# EAGLE design Linesensors (EAGLE 9.6.0)
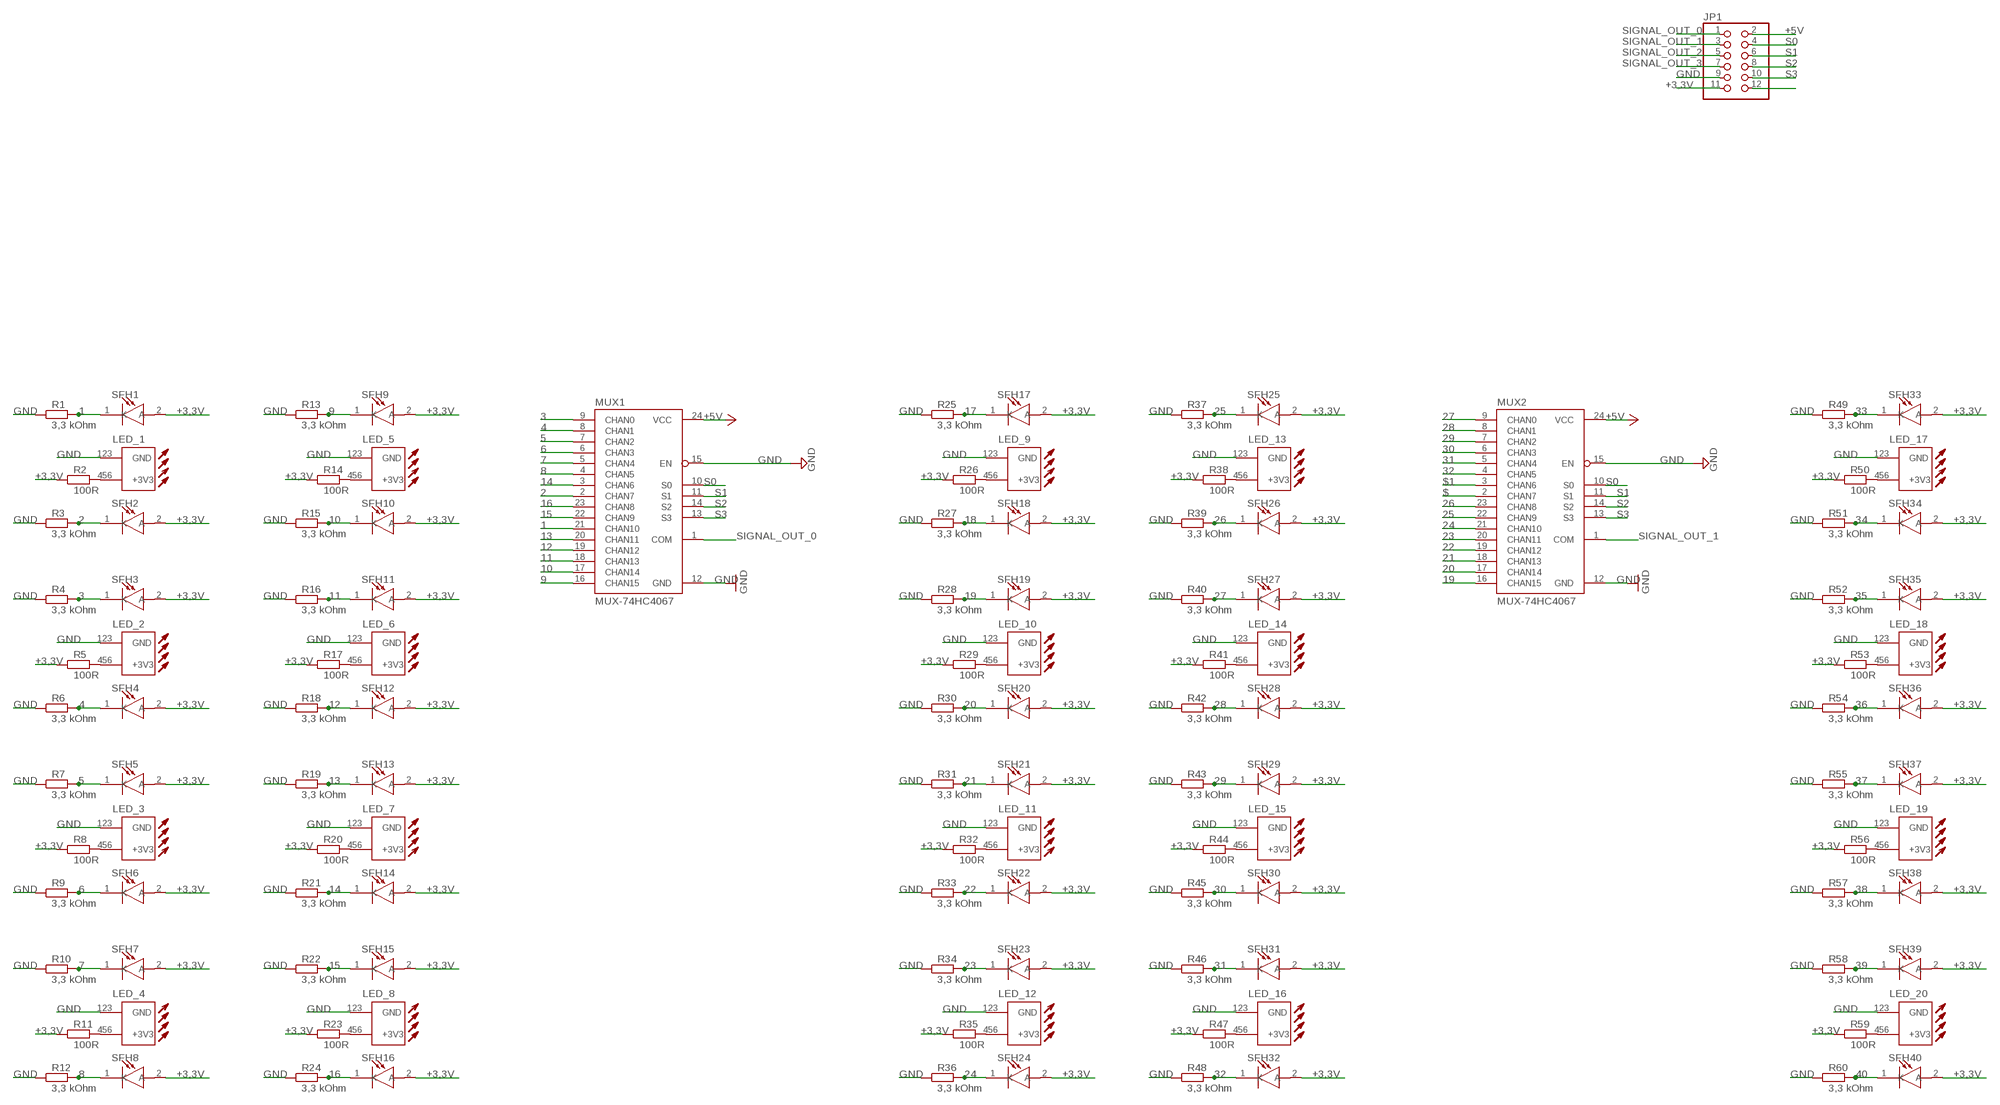
[diagram p0: schematic, sheet 1, part 1 of 2]
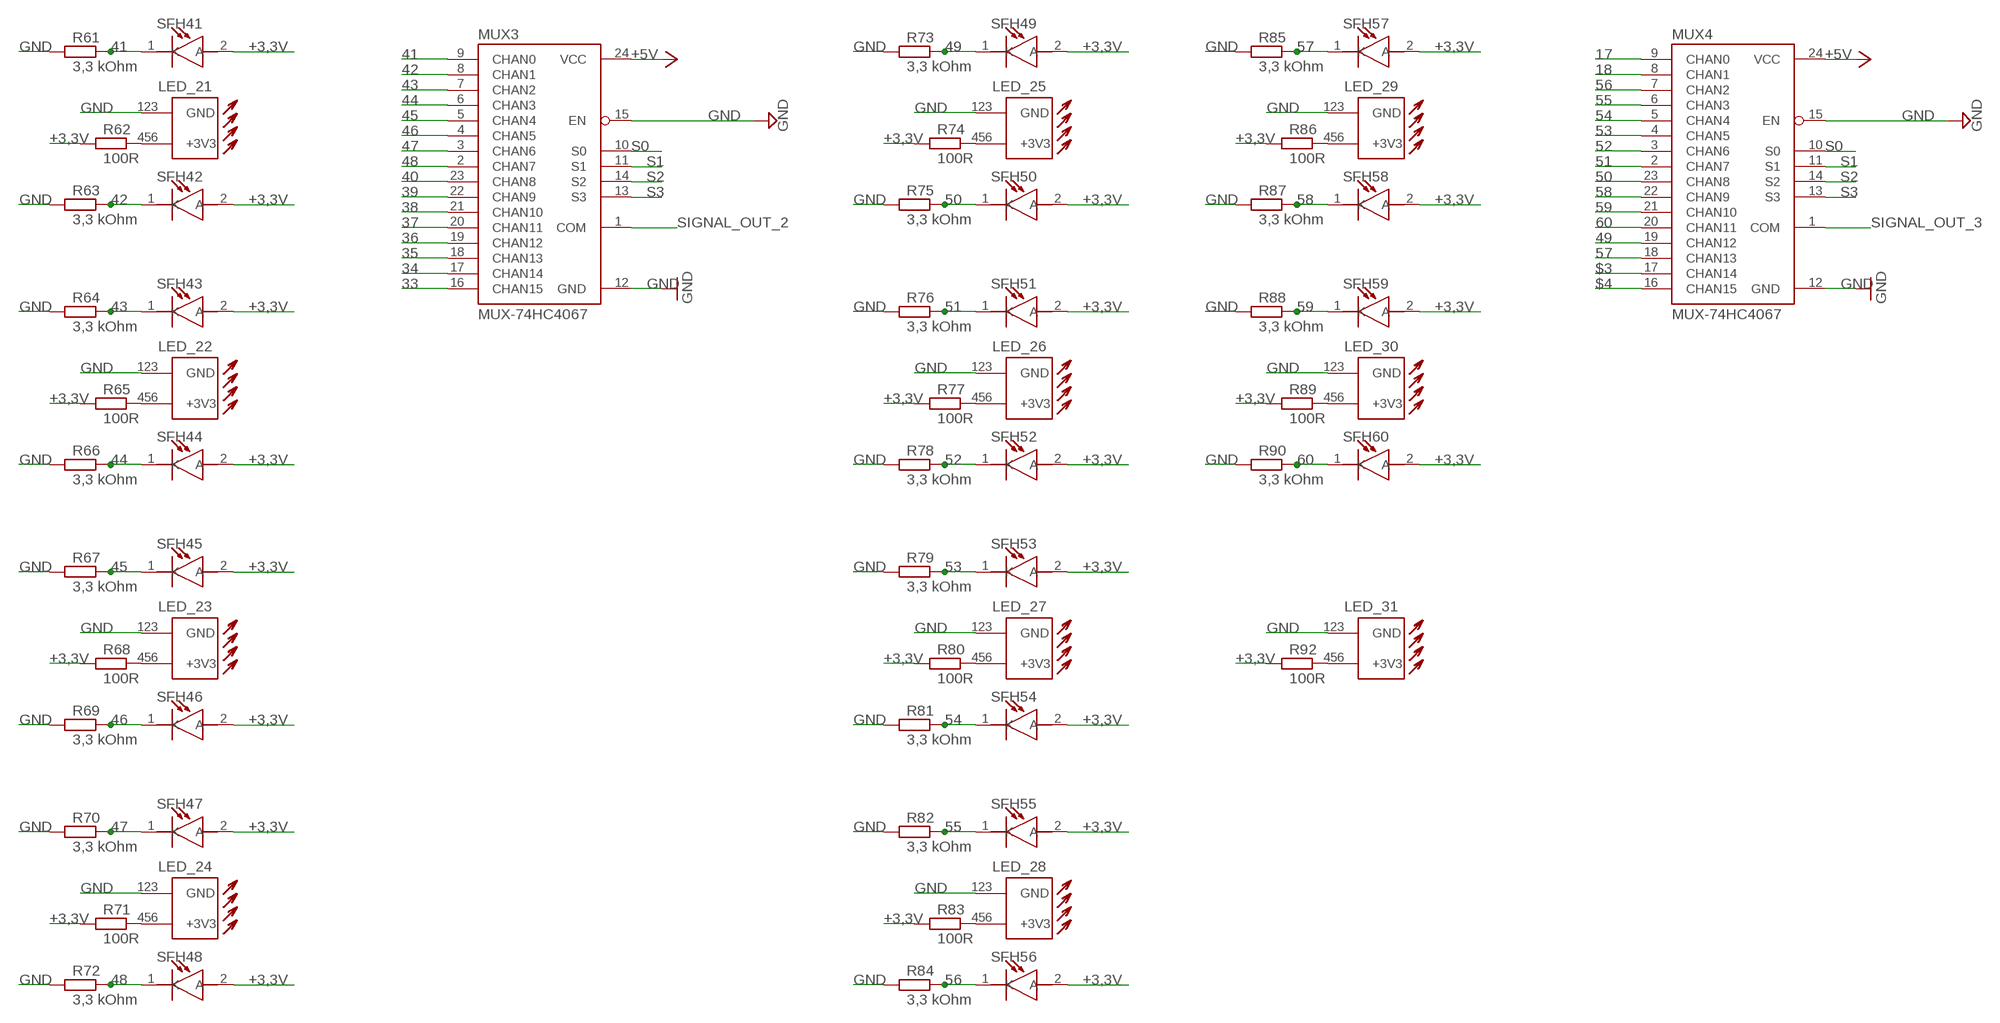
[diagram p1: schematic, sheet 1, part 2 of 2]

## Parts
JP1  PINHD-2X6  [2X06]
LED_1  RND135-00056LEDD  [LED]
LED_2  RND135-00056LEDD  [LED]
LED_3  RND135-00056LEDD  [LED]
LED_4  RND135-00056LEDD  [LED]
LED_5  RND135-00056LEDD  [LED]
LED_6  RND135-00056LEDD  [LED]
LED_7  RND135-00056LEDD  [LED]
LED_8  RND135-00056LEDD  [LED]
LED_9  RND135-00056LEDD  [LED]
LED_10  RND135-00056LEDD  [LED]
LED_11  RND135-00056LEDD  [LED]
LED_12  RND135-00056LEDD  [LED]
LED_13  RND135-00056LEDD  [LED]
LED_14  RND135-00056LEDD  [LED]
LED_15  RND135-00056LEDD  [LED]
LED_16  RND135-00056LEDD  [LED]
LED_17  RND135-00056LEDD  [LED]
LED_18  RND135-00056LEDD  [LED]
LED_19  RND135-00056LEDD  [LED]
LED_20  RND135-00056LEDD  [LED]
LED_21  RND135-00056LEDD  [LED]
LED_22  RND135-00056LEDD  [LED]
LED_23  RND135-00056LEDD  [LED]
LED_24  RND135-00056LEDD  [LED]
LED_25  RND135-00056LEDD  [LED]
LED_26  RND135-00056LEDD  [LED]
LED_27  RND135-00056LEDD  [LED]
LED_28  RND135-00056LEDD  [LED]
LED_29  RND135-00056LEDD  [LED]
LED_30  RND135-00056LEDD  [LED]
LED_31  RND135-00056LEDD  [LED]
MUX1  MUX-74HC4067  MUX-74HC4067SMD  [SSOP24]
MUX2  MUX-74HC4067  MUX-74HC4067SMD  [SSOP24]
MUX3  MUX-74HC4067  MUX-74HC4067SMD  [SSOP24]
MUX4  MUX-74HC4067  MUX-74HC4067SMD  [SSOP24]
R1  3,3 kOhm  R-EU_R1206  [R1206]
R2  100R  R-EU_R1206  [R1206]
R3  3,3 kOhm  R-EU_R1206  [R1206]
R4  3,3 kOhm  R-EU_R1206  [R1206]
R5  100R  R-EU_R1206  [R1206]
R6  3,3 kOhm  R-EU_R1206  [R1206]
R7  3,3 kOhm  R-EU_R1206  [R1206]
R8  100R  R-EU_R1206  [R1206]
R9  3,3 kOhm  R-EU_R1206  [R1206]
R10  3,3 kOhm  R-EU_R1206  [R1206]
R11  100R  R-EU_R1206  [R1206]
R12  3,3 kOhm  R-EU_R1206  [R1206]
R13  3,3 kOhm  R-EU_R1206  [R1206]
R14  100R  R-EU_R1206  [R1206]
R15  3,3 kOhm  R-EU_R1206  [R1206]
R16  3,3 kOhm  R-EU_R1206  [R1206]
R17  100R  R-EU_R1206  [R1206]
R18  3,3 kOhm  R-EU_R1206  [R1206]
R19  3,3 kOhm  R-EU_R1206  [R1206]
R20  100R  R-EU_R1206  [R1206]
R21  3,3 kOhm  R-EU_R1206  [R1206]
R22  3,3 kOhm  R-EU_R1206  [R1206]
R23  100R  R-EU_R1206  [R1206]
R24  3,3 kOhm  R-EU_R1206  [R1206]
R25  3,3 kOhm  R-EU_R1206  [R1206]
R26  100R  R-EU_R1206  [R1206]
R27  3,3 kOhm  R-EU_R1206  [R1206]
R28  3,3 kOhm  R-EU_R1206  [R1206]
R29  100R  R-EU_R1206  [R1206]
R30  3,3 kOhm  R-EU_R1206  [R1206]
R31  3,3 kOhm  R-EU_R1206  [R1206]
R32  100R  R-EU_R1206  [R1206]
R33  3,3 kOhm  R-EU_R1206  [R1206]
R34  3,3 kOhm  R-EU_R1206  [R1206]
R35  100R  R-EU_R1206  [R1206]
R36  3,3 kOhm  R-EU_R1206  [R1206]
R37  3,3 kOhm  R-EU_R1206  [R1206]
R38  100R  R-EU_R1206  [R1206]
R39  3,3 kOhm  R-EU_R1206  [R1206]
R40  3,3 kOhm  R-EU_R1206  [R1206]
R41  100R  R-EU_R1206  [R1206]
R42  3,3 kOhm  R-EU_R1206  [R1206]
R43  3,3 kOhm  R-EU_R1206  [R1206]
R44  100R  R-EU_R1206  [R1206]
R45  3,3 kOhm  R-EU_R1206  [R1206]
R46  3,3 kOhm  R-EU_R1206  [R1206]
R47  100R  R-EU_R1206  [R1206]
R48  3,3 kOhm  R-EU_R1206  [R1206]
R49  3,3 kOhm  R-EU_R1206  [R1206]
R50  100R  R-EU_R1206  [R1206]
R51  3,3 kOhm  R-EU_R1206  [R1206]
R52  3,3 kOhm  R-EU_R1206  [R1206]
R53  100R  R-EU_R1206  [R1206]
R54  3,3 kOhm  R-EU_R1206  [R1206]
R55  3,3 kOhm  R-EU_R1206  [R1206]
R56  100R  R-EU_R1206  [R1206]
R57  3,3 kOhm  R-EU_R1206  [R1206]
R58  3,3 kOhm  R-EU_R1206  [R1206]
R59  100R  R-EU_R1206  [R1206]
R60  3,3 kOhm  R-EU_R1206  [R1206]
R61  3,3 kOhm  R-EU_R1206  [R1206]
R62  100R  R-EU_R1206  [R1206]
R63  3,3 kOhm  R-EU_R1206  [R1206]
R64  3,3 kOhm  R-EU_R1206  [R1206]
R65  100R  R-EU_R1206  [R1206]
R66  3,3 kOhm  R-EU_R1206  [R1206]
R67  3,3 kOhm  R-EU_R1206  [R1206]
R68  100R  R-EU_R1206  [R1206]
R69  3,3 kOhm  R-EU_R1206  [R1206]
R70  3,3 kOhm  R-EU_R1206  [R1206]
R71  100R  R-EU_R1206  [R1206]
R72  3,3 kOhm  R-EU_R1206  [R1206]
R73  3,3 kOhm  R-EU_R1206  [R1206]
R74  100R  R-EU_R1206  [R1206]
R75  3,3 kOhm  R-EU_R1206  [R1206]
R76  3,3 kOhm  R-EU_R1206  [R1206]
R77  100R  R-EU_R1206  [R1206]
R78  3,3 kOhm  R-EU_R1206  [R1206]
R79  3,3 kOhm  R-EU_R1206  [R1206]
R80  100R  R-EU_R1206  [R1206]
R81  3,3 kOhm  R-EU_R1206  [R1206]
R82  3,3 kOhm  R-EU_R1206  [R1206]
R83  100R  R-EU_R1206  [R1206]
R84  3,3 kOhm  R-EU_R1206  [R1206]
R85  3,3 kOhm  R-EU_R1206  [R1206]
R86  100R  R-EU_R1206  [R1206]
R87  3,3 kOhm  R-EU_R1206  [R1206]
R88  3,3 kOhm  R-EU_R1206  [R1206]
R89  100R  R-EU_R1206  [R1206]
R90  3,3 kOhm  R-EU_R1206  [R1206]
R92  100R  R-EU_R1206  [R1206]
SFH1  SFH_3716  [LEDC2012X89N]
SFH2  SFH_3716  [LEDC2012X89N]
SFH3  SFH_3716  [LEDC2012X89N]
SFH4  SFH_3716  [LEDC2012X89N]
SFH5  SFH_3716  [LEDC2012X89N]
SFH6  SFH_3716  [LEDC2012X89N]
SFH7  SFH_3716  [LEDC2012X89N]
SFH8  SFH_3716  [LEDC2012X89N]
SFH9  SFH_3716  [LEDC2012X89N]
SFH10  SFH_3716  [LEDC2012X89N]
SFH11  SFH_3716  [LEDC2012X89N]
SFH12  SFH_3716  [LEDC2012X89N]
SFH13  SFH_3716  [LEDC2012X89N]
SFH14  SFH_3716  [LEDC2012X89N]
SFH15  SFH_3716  [LEDC2012X89N]
SFH16  SFH_3716  [LEDC2012X89N]
SFH17  SFH_3716  [LEDC2012X89N]
SFH18  SFH_3716  [LEDC2012X89N]
SFH19  SFH_3716  [LEDC2012X89N]
SFH20  SFH_3716  [LEDC2012X89N]
SFH21  SFH_3716  [LEDC2012X89N]
SFH22  SFH_3716  [LEDC2012X89N]
SFH23  SFH_3716  [LEDC2012X89N]
SFH24  SFH_3716  [LEDC2012X89N]
SFH25  SFH_3716  [LEDC2012X89N]
SFH26  SFH_3716  [LEDC2012X89N]
SFH27  SFH_3716  [LEDC2012X89N]
SFH28  SFH_3716  [LEDC2012X89N]
SFH29  SFH_3716  [LEDC2012X89N]
SFH30  SFH_3716  [LEDC2012X89N]
SFH31  SFH_3716  [LEDC2012X89N]
SFH32  SFH_3716  [LEDC2012X89N]
SFH33  SFH_3716  [LEDC2012X89N]
SFH34  SFH_3716  [LEDC2012X89N]
SFH35  SFH_3716  [LEDC2012X89N]
SFH36  SFH_3716  [LEDC2012X89N]
SFH37  SFH_3716  [LEDC2012X89N]
SFH38  SFH_3716  [LEDC2012X89N]
SFH39  SFH_3716  [LEDC2012X89N]
SFH40  SFH_3716  [LEDC2012X89N]
SFH41  SFH_3716  [LEDC2012X89N]
SFH42  SFH_3716  [LEDC2012X89N]
SFH43  SFH_3716  [LEDC2012X89N]
SFH44  SFH_3716  [LEDC2012X89N]
SFH45  SFH_3716  [LEDC2012X89N]
SFH46  SFH_3716  [LEDC2012X89N]
SFH47  SFH_3716  [LEDC2012X89N]
SFH48  SFH_3716  [LEDC2012X89N]
SFH49  SFH_3716  [LEDC2012X89N]
SFH50  SFH_3716  [LEDC2012X89N]
SFH51  SFH_3716  [LEDC2012X89N]
SFH52  SFH_3716  [LEDC2012X89N]
SFH53  SFH_3716  [LEDC2012X89N]
SFH54  SFH_3716  [LEDC2012X89N]
SFH55  SFH_3716  [LEDC2012X89N]
SFH56  SFH_3716  [LEDC2012X89N]
SFH57  SFH_3716  [LEDC2012X89N]
SFH58  SFH_3716  [LEDC2012X89N]
SFH59  SFH_3716  [LEDC2012X89N]
SFH60  SFH_3716  [LEDC2012X89N]

## Nets
1: MUX1.21(CHAN10) R1.2 SFH1.1(K)
2: MUX1.2(CHAN7) R3.2 SFH2.1(K)
3: MUX1.9(CHAN0) R4.2 SFH3.1(K)
4: MUX1.8(CHAN1) R6.2 SFH4.1(K)
5: MUX1.7(CHAN2) R7.2 SFH5.1(K)
6: MUX1.6(CHAN3) R9.2 SFH6.1(K)
7: MUX1.5(CHAN4) R10.2 SFH7.1(K)
8: MUX1.4(CHAN5) R12.2 SFH8.1(K)
9: MUX1.16(CHAN15) R13.2 SFH9.1(K)
10: MUX1.17(CHAN14) R15.2 SFH10.1(K)
11: MUX1.18(CHAN13) R16.2 SFH11.1(K)
12: MUX1.19(CHAN12) R18.2 SFH12.1(K)
13: MUX1.20(CHAN11) R19.2 SFH13.1(K)
14: MUX1.3(CHAN6) R21.2 SFH14.1(K)
15: MUX1.22(CHAN9) R22.2 SFH15.1(K)
16: MUX1.23(CHAN8) R24.2 SFH16.1(K)
17: MUX4.9(CHAN0) R25.2 SFH17.1(K)
18: MUX4.8(CHAN1) R27.2 SFH18.1(K)
19: MUX2.16(CHAN15) R28.2 SFH19.1(K)
20: MUX2.17(CHAN14) R30.2 SFH20.1(K)
21: MUX2.18(CHAN13) R31.2 SFH21.1(K)
22: MUX2.19(CHAN12) R33.2 SFH22.1(K)
23: MUX2.20(CHAN11) R34.2 SFH23.1(K)
24: MUX2.21(CHAN10) R36.2 SFH24.1(K)
25: MUX2.22(CHAN9) R37.2 SFH25.1(K)
26: MUX2.23(CHAN8) R39.2 SFH26.1(K)
27: MUX2.9(CHAN0) R40.2 SFH27.1(K)
28: MUX2.8(CHAN1) R42.2 SFH28.1(K)
29: MUX2.7(CHAN2) R43.2 SFH29.1(K)
30: MUX2.6(CHAN3) R45.2 SFH30.1(K)
31: MUX2.5(CHAN4) R46.2 SFH31.1(K)
32: MUX2.4(CHAN5) R48.2 SFH32.1(K)
33: MUX3.16(CHAN15) R49.2 SFH33.1(K)
34: MUX3.17(CHAN14) R51.2 SFH34.1(K)
35: MUX3.18(CHAN13) R52.2 SFH35.1(K)
36: MUX3.19(CHAN12) R54.2 SFH36.1(K)
37: MUX3.20(CHAN11) R55.2 SFH37.1(K)
38: MUX3.21(CHAN10) R57.2 SFH38.1(K)
39: MUX3.22(CHAN9) R58.2 SFH39.1(K)
40: MUX3.23(CHAN8) R60.2 SFH40.1(K)
41: MUX3.9(CHAN0) R61.2 SFH41.1(K)
42: MUX3.8(CHAN1) R63.2 SFH42.1(K)
43: MUX3.7(CHAN2) R64.2 SFH43.1(K)
44: MUX3.6(CHAN3) R66.2 SFH44.1(K)
45: MUX3.5(CHAN4) R67.2 SFH45.1(K)
46: MUX3.4(CHAN5) R69.2 SFH46.1(K)
47: MUX3.3(CHAN6) R70.2 SFH47.1(K)
48: MUX3.2(CHAN7) R72.2 SFH48.1(K)
49: MUX4.19(CHAN12) R73.2 SFH49.1(K)
50: MUX4.23(CHAN8) R75.2 SFH50.1(K)
51: MUX4.2(CHAN7) R76.2 SFH51.1(K)
52: MUX4.3(CHAN6) R78.2 SFH52.1(K)
53: MUX4.4(CHAN5) R79.2 SFH53.1(K)
54: MUX4.5(CHAN4) R81.2 SFH54.1(K)
55: MUX4.6(CHAN3) R82.2 SFH55.1(K)
56: MUX4.7(CHAN2) R84.2 SFH56.1(K)
57: MUX4.18(CHAN13) R85.2 SFH57.1(K)
58: MUX4.22(CHAN9) R87.2 SFH58.1(K)
59: MUX4.21(CHAN10) R88.2 SFH59.1(K)
60: MUX4.20(CHAN11) R90.2 SFH60.1(K)
$: MUX2.2(CHAN7)
$1: MUX2.3(CHAN6)
$3: MUX4.17(CHAN14)
$4: MUX4.16(CHAN15)
+3,3V: JP1.11 R2.1 R5.1 R8.1 R11.1 R14.1 R17.1 R20.1 R23.1 R26.1 R29.1 R32.1 R35.1 R38.1 R41.1 R44.1 R47.1 R50.1 R53.1 R56.1 R59.1 R62.1 R65.1 R68.1 R71.1 R74.1 R77.1 R80.1 R83.1 R86.1 R89.1 R92.1 SFH1.2(A) SFH2.2(A) SFH3.2(A) SFH4.2(A) SFH5.2(A) SFH6.2(A) SFH7.2(A) SFH8.2(A) SFH9.2(A) SFH10.2(A) SFH11.2(A) SFH12.2(A) SFH13.2(A) SFH14.2(A) SFH15.2(A) SFH16.2(A) SFH17.2(A) SFH18.2(A) SFH19.2(A) SFH20.2(A) SFH21.2(A) SFH22.2(A) SFH23.2(A) SFH24.2(A) SFH25.2(A) SFH26.2(A) SFH27.2(A) SFH28.2(A) SFH29.2(A) SFH30.2(A) SFH31.2(A) SFH32.2(A) SFH33.2(A) SFH34.2(A) SFH35.2(A) SFH36.2(A) SFH37.2(A) SFH38.2(A) SFH39.2(A) SFH40.2(A) SFH41.2(A) SFH42.2(A) SFH43.2(A) SFH44.2(A) SFH45.2(A) SFH46.2(A) SFH47.2(A) SFH48.2(A) SFH49.2(A) SFH50.2(A) SFH51.2(A) SFH52.2(A) SFH53.2(A) SFH54.2(A) SFH55.2(A) SFH56.2(A) SFH57.2(A) SFH58.2(A) SFH59.2(A) SFH60.2(A)
+5V: JP1.2 MUX1.24(VCC) MUX2.24(VCC) MUX3.24(VCC) MUX4.24(VCC)
ADFAF1: LED_2.456(+3V3) R5.2
ADFAF2: LED_3.456(+3V3) R8.2
ADFAF3: LED_4.456(+3V3) R11.2
ADFAF4: LED_1.456(+3V3) R2.2
ADFAF5: LED_5.456(+3V3) R14.2
ADFAF6: LED_6.456(+3V3) R17.2
ADFAF7: LED_7.456(+3V3) R20.2
ADFAF8: LED_8.456(+3V3) R23.2
ADFAF9: LED_9.456(+3V3) R26.2
ADFAF10: LED_10.456(+3V3) R29.2
ADFAF11: LED_11.456(+3V3) R32.2
ADFAF12: LED_12.456(+3V3) R35.2
ADFAF13: LED_13.456(+3V3) R38.2
ADFAF14: LED_14.456(+3V3) R41.2
ADFAF15: LED_15.456(+3V3) R44.2
ADFAF16: LED_16.456(+3V3) R47.2
ADFAF17: LED_17.456(+3V3) R50.2
ADFAF18: LED_18.456(+3V3) R53.2
ADFAF19: LED_19.456(+3V3) R56.2
ADFAF20: LED_20.456(+3V3) R59.2
ADFAF21: LED_21.456(+3V3) R62.2
ADFAF22: LED_22.456(+3V3) R65.2
ADFAF23: LED_23.456(+3V3) R68.2
ADFAF24: LED_24.456(+3V3) R71.2
ADFAF25: LED_25.456(+3V3) R74.2
ADFAF26: LED_26.456(+3V3) R77.2
ADFAF27: LED_27.456(+3V3) R80.2
ADFAF28: LED_28.456(+3V3) R83.2
ADFAF29: LED_29.456(+3V3) R86.2
ADFAF30: LED_30.456(+3V3) R89.2
ADFAF31: LED_31.456(+3V3) R92.2
GND: JP1.9 LED_1.123(GND) LED_2.123(GND) LED_3.123(GND) LED_4.123(GND) LED_5.123(GND) LED_6.123(GND) LED_7.123(GND) LED_8.123(GND) LED_9.123(GND) LED_10.123(GND) LED_11.123(GND) LED_12.123(GND) LED_13.123(GND) LED_14.123(GND) LED_15.123(GND) LED_16.123(GND) LED_17.123(GND) LED_18.123(GND) LED_19.123(GND) LED_20.123(GND) LED_21.123(GND) LED_22.123(GND) LED_23.123(GND) LED_24.123(GND) LED_25.123(GND) LED_26.123(GND) LED_27.123(GND) LED_28.123(GND) LED_29.123(GND) LED_30.123(GND) LED_31.123(GND) MUX1.12(GND) MUX1.15(EN) MUX2.12(GND) MUX2.15(EN) MUX3.12(GND) MUX3.15(EN) MUX4.12(GND) MUX4.15(EN) R1.1 R3.1 R4.1 R6.1 R7.1 R9.1 R10.1 R12.1 R13.1 R15.1 R16.1 R18.1 R19.1 R21.1 R22.1 R24.1 R25.1 R27.1 R28.1 R30.1 R31.1 R33.1 R34.1 R36.1 R37.1 R39.1 R40.1 R42.1 R43.1 R45.1 R46.1 R48.1 R49.1 R51.1 R52.1 R54.1 R55.1 R57.1 R58.1 R60.1 R61.1 R63.1 R64.1 R66.1 R67.1 R69.1 R70.1 R72.1 R73.1 R75.1 R76.1 R78.1 R79.1 R81.1 R82.1 R84.1 R85.1 R87.1 R88.1 R90.1
N$12: JP1.12
S0: JP1.4 MUX1.10(S0) MUX2.10(S0) MUX3.10(S0) MUX4.10(S0)
S1: JP1.6 MUX1.11(S1) MUX2.11(S1) MUX3.11(S1) MUX4.11(S1)
S2: JP1.8 MUX1.14(S2) MUX2.14(S2) MUX3.14(S2) MUX4.14(S2)
S3: JP1.10 MUX1.13(S3) MUX2.13(S3) MUX3.13(S3) MUX4.13(S3)
SIGNAL_OUT_0: JP1.1 MUX1.1(COM)
SIGNAL_OUT_1: JP1.3 MUX2.1(COM)
SIGNAL_OUT_2: JP1.5 MUX3.1(COM)
SIGNAL_OUT_3: JP1.7 MUX4.1(COM)

## Library data of the parts
JP1 = pinhead:PINHD-2X6: PIN HEADER
LED_1-LED_31 = RND_135-00056:RND135-00056LED
MUX1-MUX4 = SparkFun:MUX-74HC4067
R1-R90 R92 = rcl:R-EU_: RESISTOR, European symbol
SFH1-SFH60 = SamacSys_Parts:SFH_3716: Osram Opto SFH 3716 Ambient Light Sensor Unit Surface Mount 2-Pin Source: Datasheet <https://dammedia.osram.info/media/resource/hires/osram-dam-2496086/SFH 3716.pdf>; DESCRIPTION: Osram Opto SFH 3716 Ambient Light Sensor Unit Surface Mount 2-Pin; HEIGHT: 0.89mm; MANUFACTURER_NAME: OSRAM Opto Semiconductors; MANUFACTURER_PART_NUMBER: SFH 3716; MOUSER_PART_NUMBER: 720-SFH3716; MOUSER_PRICE-STOCK: https://www.mouser.com/Search/Refine.aspx?Keyword=720-SFH3716; RS_PART_NUMBER: 1115952P; RS_PRICE-STOCK: http://uk.rs-online.com/web/p/products/1115952P

## Net classes
1 5v: width 0.813 mm, drill 0.8 mm

## Board
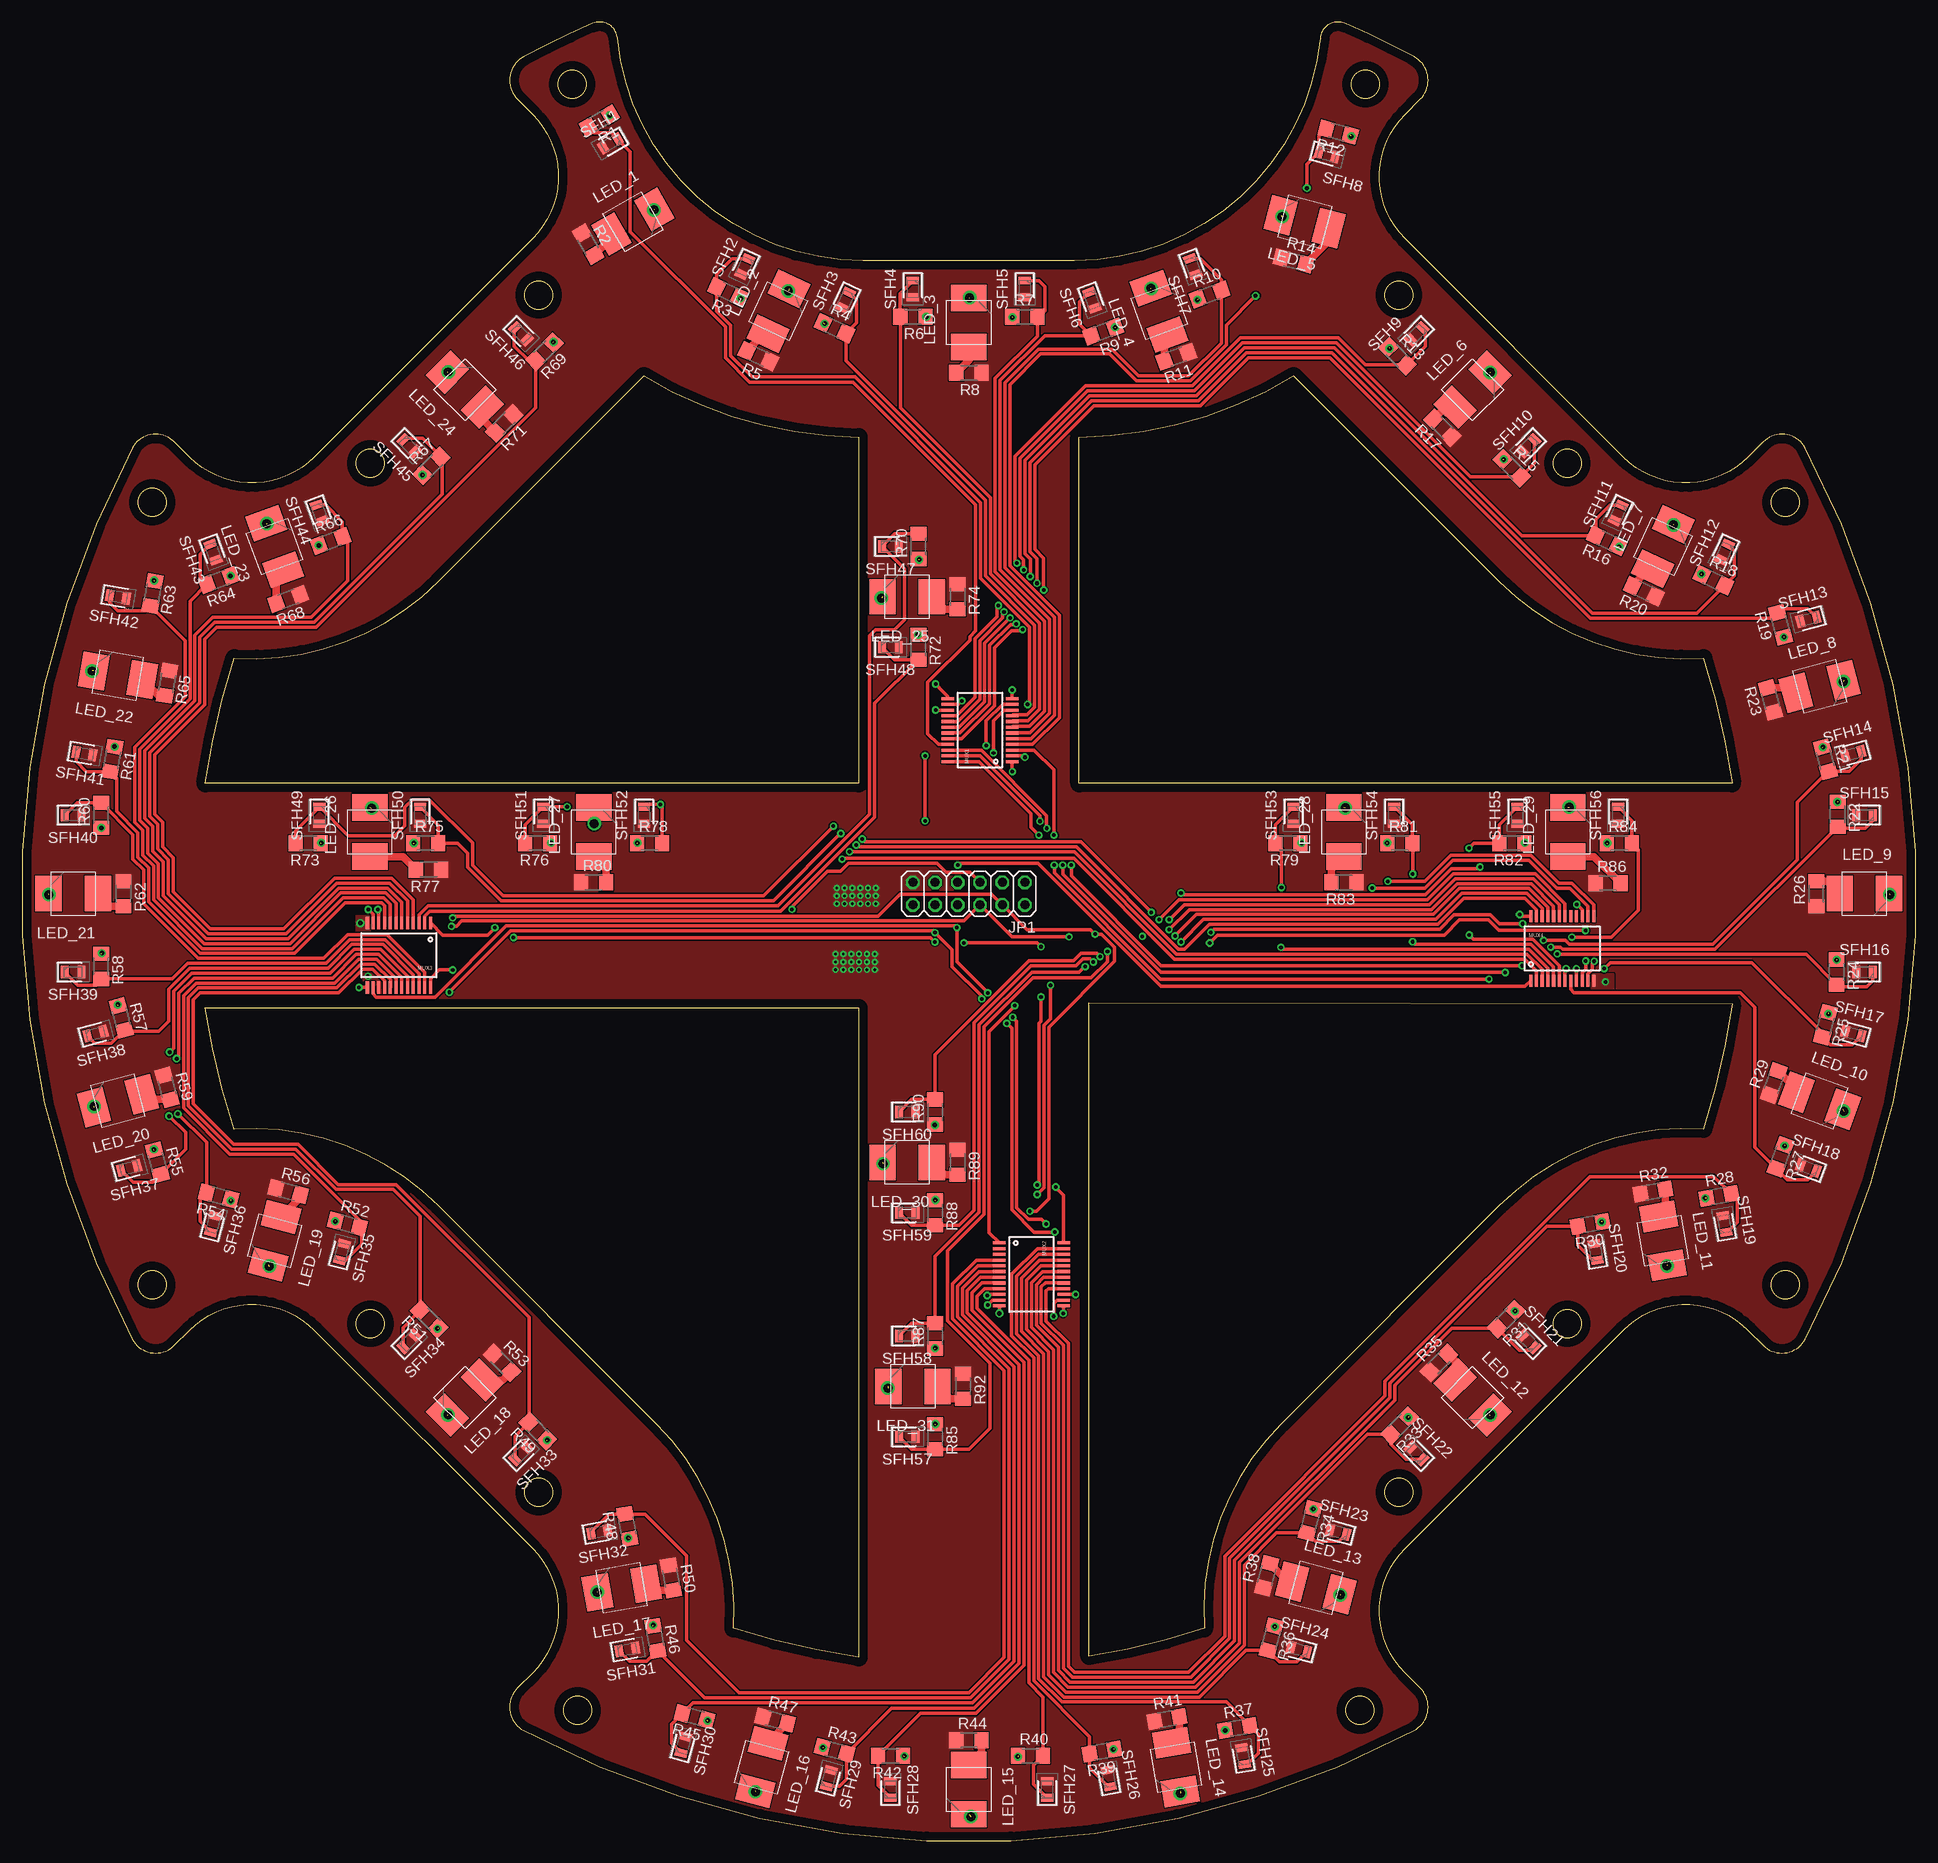
[diagram p2: board, top side]
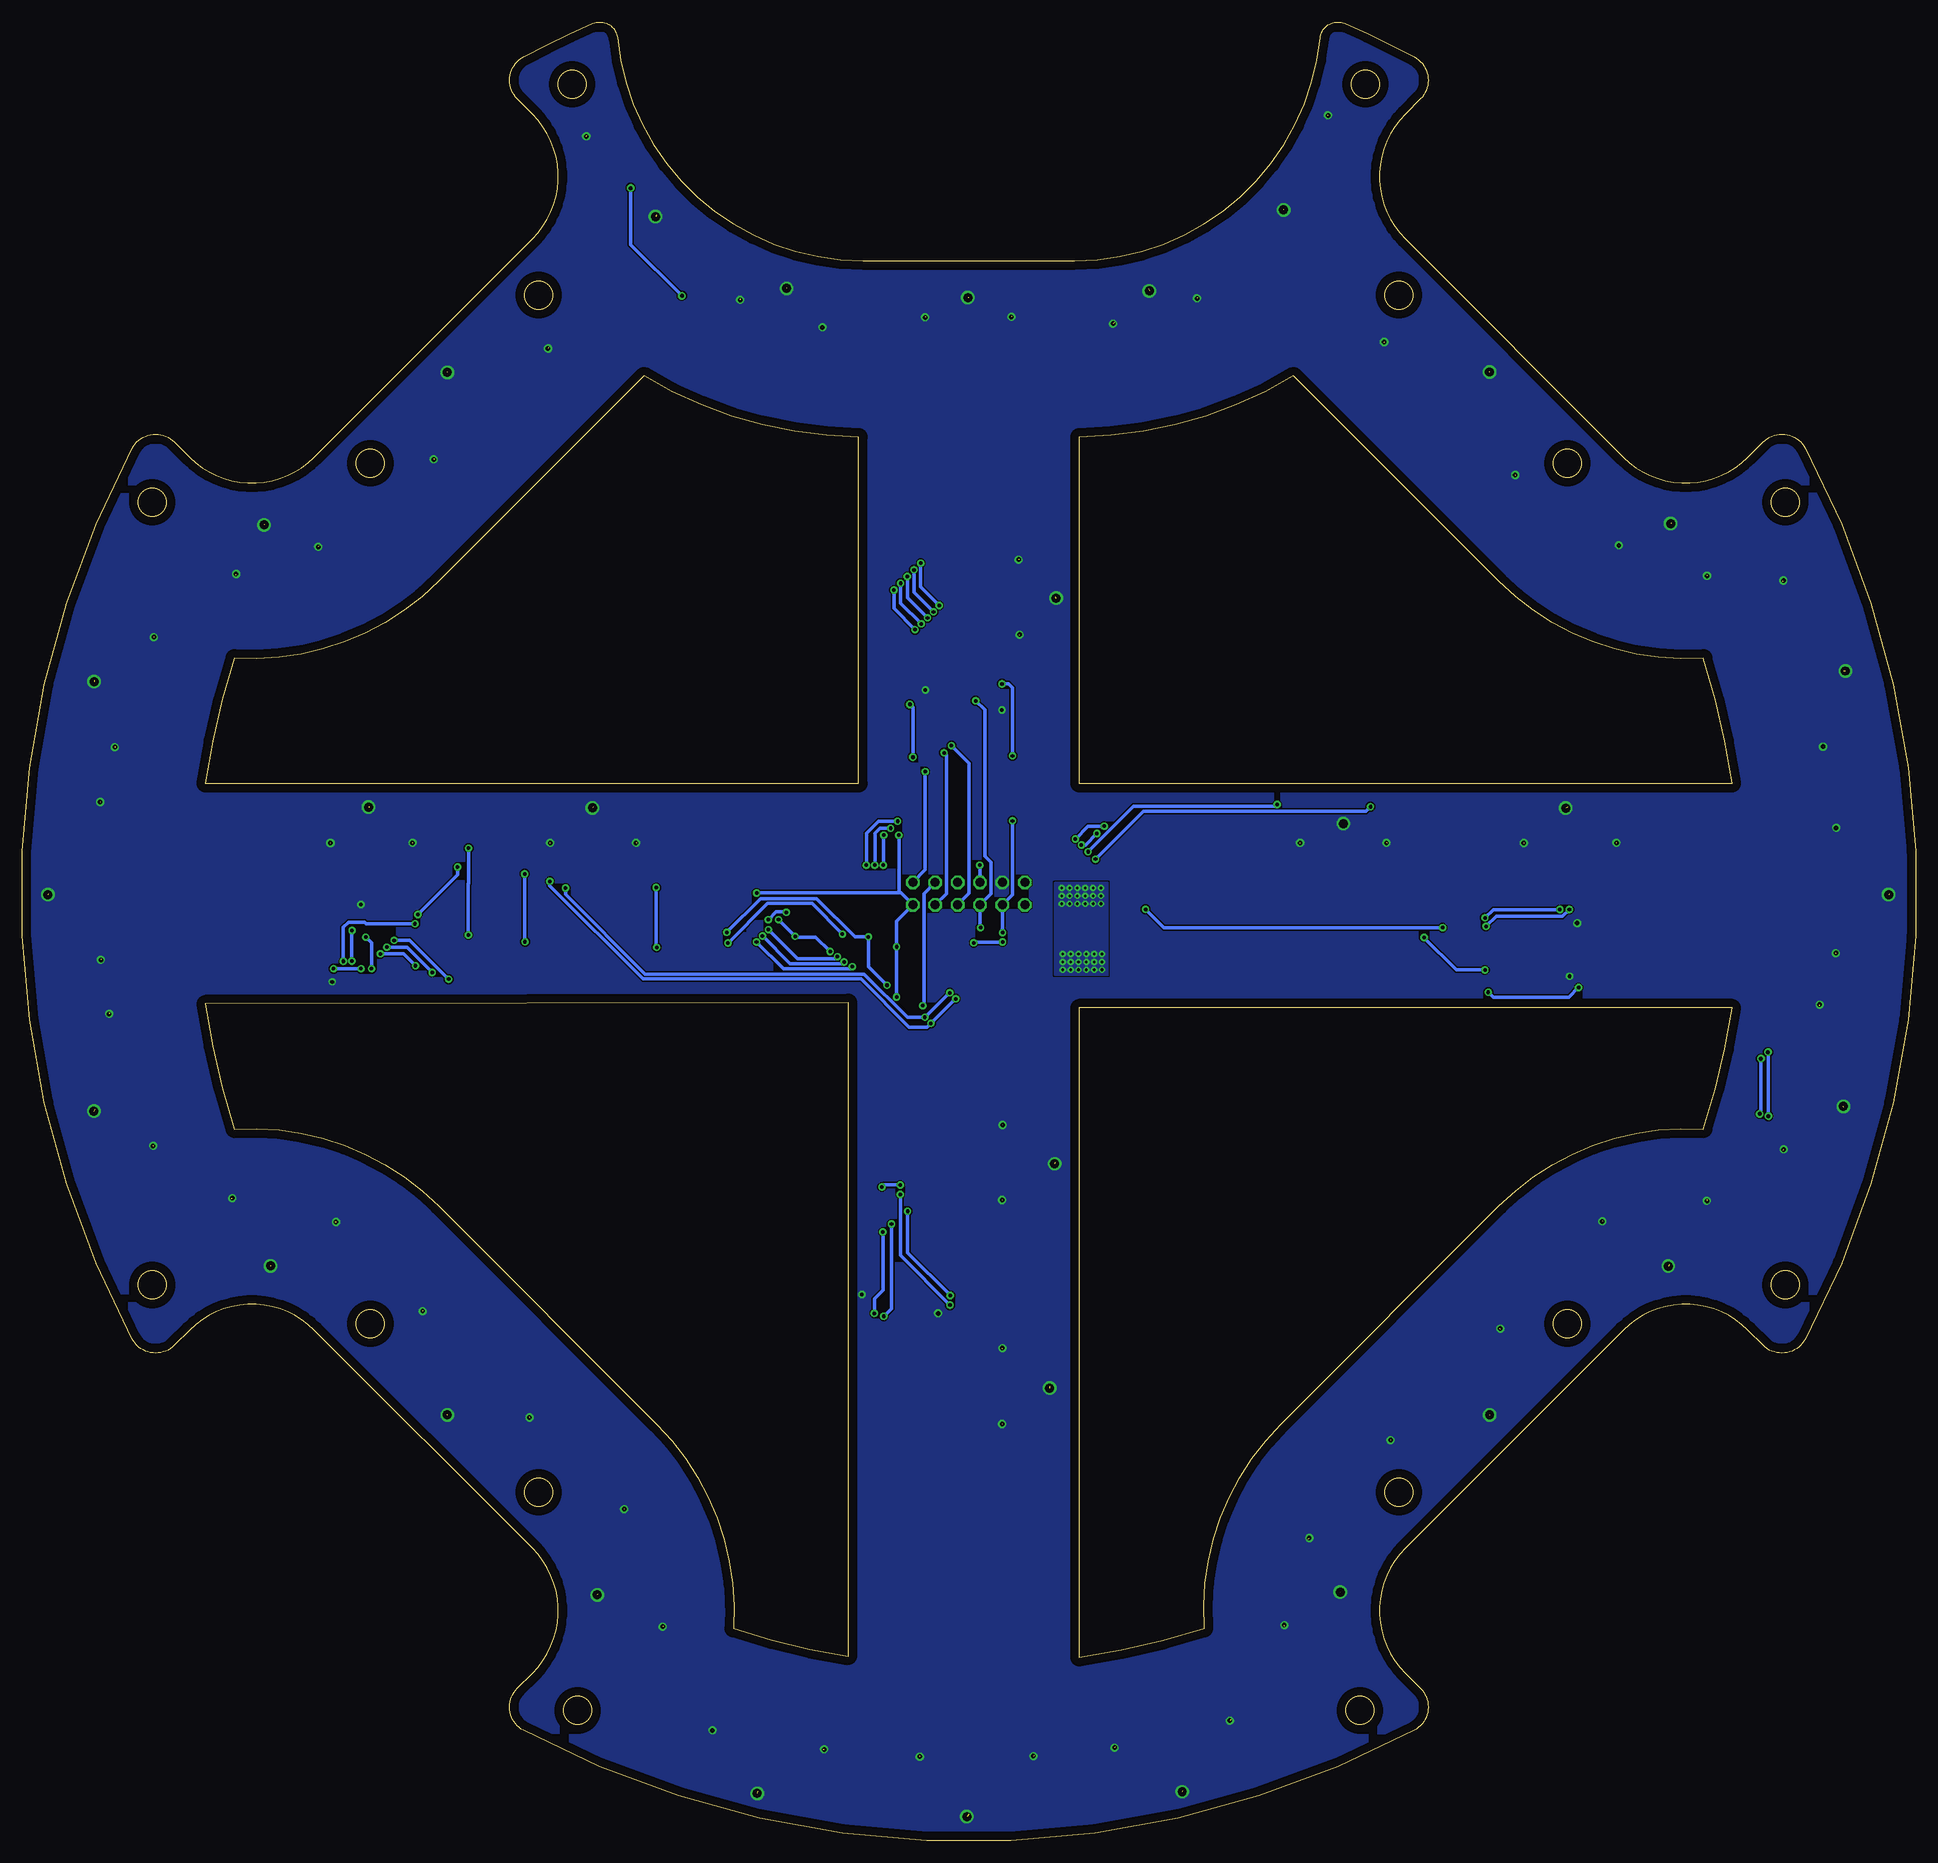
[diagram p3: board, bottom side, seen from below]

Size 214.79 x 206.24 mm. Coordinates in mm from the lower left corner, seen from the top.
Outline: 94.89,20.79 arc-10 80.68,24.07 arc49 71.99,47.24 47.24,71.99 arc49 24.07,80.68 arc-10 20.79,94.44 94.89,94.44 94.89,20.79
Outline: 121.04,20.92 121.04,95.02 194,94.89 arc-10 190.72,80.68 arc49 167.55,71.99 142.8,47.24 arc49 134.1,24.07 arc-10 121.04,20.92
Outline: 20.79,119.89 arc-10 24.07,134.1 arc49 47.24,142.8 70.54,166.11 arc31 94.89,159.18 94.89,119.89 20.79,119.89
Outline: 150.04,206.07 arc108 147.26,204.43 arc-84 119.39,179.17 95.39,179.17 arc-84 67.53,204.43 arc108 64.74,206.07 arc5 56.88,202.28 arc107 56.16,197.51 57.9,195.78 arc-90 57.9,181.64 33.15,156.89 arc-90 19.01,156.89 17.27,158.62 arc107 12.5,157.91 arc56 12.5,56.88 arc107 17.27,56.16 19.01,57.9 arc-90 33.15,57.9 57.9,33.15 arc-90 57.9,19.01 56.16,17.27 arc107 56.88,12.5 arc56 157.91,12.5 arc107 158.62,17.27 156.89,19.01 arc-90 156.89,33.15 181.64,57.9 arc-90 195.78,57.9 197.51,56.16 arc107 202.28,56.88 arc56 202.28,157.91 arc107 197.51,158.62 195.78,156.89 arc-90 181.64,156.89 156.89,181.64 arc-90 156.89,195.78 158.62,197.51 arc107 157.91,202.28 arc5 150.04,206.07
Outline: 194,119.89 119.89,119.89 119.89,159.18 arc31 144.24,166.11 167.55,142.8 arc49 190.72,134.1 arc-10 194,119.89
Outline: circle at 39.51,156.18 radius 1.6
Outline: circle at 39.51,58.6 radius 1.6
Outline: circle at 175.28,58.6 radius 1.6
Outline: circle at 175.28,156.18 radius 1.6
Outline: circle at 58.6,175.28 radius 1.6
Outline: circle at 58.6,39.51 radius 1.6
Outline: circle at 156.18,39.51 radius 1.6
Outline: circle at 156.18,175.28 radius 1.6
Outline: circle at 62.39,199.17 radius 1.6
Outline: circle at 152.39,199.17 radius 1.6
Outline: circle at 14.76,151.77 radius 1.6
Outline: circle at 200.02,63.02 radius 1.6
Outline: circle at 151.77,14.76 radius 1.6
Outline: circle at 14.76,63.02 radius 1.6
Outline: circle at 200.02,151.77 radius 1.6
Outline: circle at 63.02,14.76 radius 1.6
Copper layers (1*16): Top 0.035mm / dielectric 1.5mm / Bottom 0.035mm
Design rules "default": minimum track width 6mil, minimum drill 0.35mm, track to track 6mil, track to pad 6mil, pad to pad 6mil, via to via 6mil, smd to smd 6mil, copper to edge 40mil, drill to drill 6mil, minimum pad ring 10mil, minimum via ring 8mil, stop-mask expansion 4mil, vias tented up to drill 0mil, thermal gap 10mil

### Footprints (pad centres in the part's own frame; a part is rotated, then mirrored left to right if it is on the bottom)
2X06 = drill 1.016 octagon: 1 -6.35,-1.27; 2 -6.35,1.27; 3 -3.81,-1.27; 4 -3.81,1.27; 5 -1.27,-1.27; 6 -1.27,1.27; 7 1.27,-1.27; 8 1.27,1.27; 9 3.81,-1.27; 10 3.81,1.27; 11 6.35,-1.27; 12 6.35,1.27
LED = smd 3 x 4: 123 2.8,0; 456 -2.8,0
SSOP24 = smd 0.348 x 1.397: 1 -3.575,-3.656; 2 -2.925,-3.656; 3 -2.275,-3.656; 4 -1.625,-3.656; 5 -0.975,-3.656; 6 -0.325,-3.656; 7 0.325,-3.656; 8 0.975,-3.656; 9 1.625,-3.656; 10 2.275,-3.656; 11 2.925,-3.656; 12 3.575,-3.656; 13 3.575,3.656; 14 2.925,3.656; 15 2.275,3.656; 16 1.625,3.656; 17 0.975,3.656; 18 0.325,3.656; 19 -0.325,3.656; 20 -0.975,3.656; 21 -1.625,3.656; 22 -2.275,3.656; 23 -2.925,3.656; 24 -3.575,3.656
R1206 = smd 1.6 x 1.803: 1 -1.422,0; 2 1.422,0
LEDC2012X89N = smd 0.9 x 1.4: 1 -0.95,0; 2 0.95,0

### Placement (x,y rotation side)
JP1  107.39,107.39 180 top
LED_1  69.29,183.59 30 top
LED_2  85.8,173.43 65 top
LED_3  107.39,172.16 90 top
LED_4  128.98,173.43 110 top
LED_5  145.49,183.59 165 top
LED_6  164.54,164.54 45 top
LED_7  186.13,146.76 65 top
LED_8  203.91,130.89 15 top
LED_9  208.99,107.39 0 top
LED_10  203.91,83.9 340 top
LED_11  186.13,68.02 280 top
LED_12  164.54,50.24 315 top
LED_13  146.76,28.65 345 top
LED_14  130.89,8.33 280 top
LED_15  107.39,5.79 270 top
LED_16  83.9,8.33 255 top
LED_17  68.02,28.65 190 top
LED_18  50.24,50.24 225 top
LED_19  28.65,68.02 255 top
LED_20  10.87,83.9 195 top
LED_21  5.79,107.39 180 top
LED_22  10.87,132.16 170 top
LED_23  28.65,146.76 110 top
LED_24  50.24,164.54 135 top
LED_25  100.41,141.05 180 top
LED_26  39.45,114.38 90 top
LED_27  64.85,114.38 90 top
LED_28  149.94,114.38 90 top
LED_29  175.34,114.38 90 top
LED_30  100.41,76.91 180 top
LED_31  101.04,51.51 180 top
MUX1  108.66,125.94 90 top
MUX2  114.51,64.21 270 top
MUX3  42.75,100.41 180 top
MUX4  174.7,101.17 0 top
R1  65.48,195.02 210 top
R2  64.21,181.05 300 top
R3  80.09,175.59 155 top
R4  92.15,171.53 335 top
R5  83.52,168.35 155 top
R6  101.04,172.8 180 top
R7  113.74,172.8 0 top
R8  107.39,166.45 180 top
R9  122.63,171.15 200 top
R10  134.7,175.34 20 top
R11  130.91,168.28 200 top
R12  149.3,193.75 165 top
R13  156.03,168.35 315 top
R14  144.22,179.15 345 top
R15  168.99,155.65 315 top
R16  179.78,147.4 155 top
R17  161.11,160.23 135 top
R18  191.85,142.95 335 top
R19  199.47,137.87 105 top
R20  183.97,141.68 155 top
R21  204.55,122.63 285 top
R22  205.95,116.41 270 top
R23  198.33,129.36 105 top
R24  205.82,98.5 270 top
R25  204.55,92.53 255 top
R26  203.53,107.39 90 top
R27  199.47,77.55 250 top
R28  192.48,73.1 10 top
R29  198.71,85.93 70 top
R30  177.88,69.93 190 top
R31  168.35,59.13 225 top
R32  184.99,73.61 10 top
R33  156.29,47.07 225 top
R34  146.13,36.27 255 top
R35  160.73,54.18 45 top
R36  141.68,22.94 255 top
R37  137.87,12.78 10 top
R38  141.18,30.05 75 top
R39  122.51,10.11 190 top
R40  114.38,9.6 0 top
R41  129.87,13.79 10 top
R42  98.5,9.6 180 top
R43  92.15,10.24 345 top
R44  107.39,11.38 0 top
R45  76.28,14.05 165 top
R46  71.83,22.94 280 top
R47  85.42,13.67 345 top
R48  68.66,35.64 100 top
R49  58.5,46.43 135 top
R50  73.61,29.8 280 top
R51  46.18,59.13 135 top
R52  36.91,69.93 345 top
R53  54.43,54.18 315 top
R54  22.3,73.1 165 top
R55  15.37,76.94 285 top
R56  30.18,73.61 345 top
R57  11.25,93.3 285 top
R58  8.97,99.14 270 top
R59  16.46,85.42 285 top
R60  8.97,116.28 90 top
R61  10.24,122.63 260 top
R62  11.51,107.39 270 top
R63  14.81,141.43 260 top
R64  22.3,142.95 200 top
R65  16.46,131.27 260 top
R66  35,147.4 20 top
R67  46.43,155.91 45 top
R68  30.18,140.79 200 top
R69  59.26,168.86 225 top
R70  101.68,146.76 90 top
R71  54.69,160.73 225 top
R72  101.68,135.33 270 top
R73  32.46,113.11 180 top
R74  106.12,141.05 270 top
R75  45.8,113.11 0 top
R76  58.5,113.11 180 top
R77  46.1,110.11 180 top
R78  71.2,113.11 0 top
R79  143.59,113.11 180 top
R80  64.85,108.66 0 top
R81  156.29,113.11 0 top
R82  168.99,113.11 180 top
R83  149.94,108.66 180 top
R84  181.18,113.11 0 top
R85  103.58,45.8 270 top
R86  179.91,108.56 0 top
R87  103.58,57.23 90 top
R88  103.58,71.2 270 top
R89  106.12,76.91 270 top
R90  103.58,82.63 90 top
R92  106.76,51.51 270 top
SFH1  66.75,192.48 210 top
SFH2  81.99,178.51 245 top
SFH3  93.42,174.7 245 top
SFH4  101.04,175.97 270 top
SFH5  113.74,175.97 270 top
SFH6  121.36,174.7 290 top
SFH7  132.79,178.51 290 top
SFH8  148.03,191.21 345 top
SFH9  158.19,170.89 225 top
SFH10  170.89,158.19 225 top
SFH11  181.05,150.57 245 top
SFH12  193.12,146.13 245 top
SFH13  202.64,138.51 195 top
SFH14  207.72,123.27 195 top
SFH15  208.99,116.28 180 top
SFH16  208.99,98.5 180 top
SFH17  207.72,91.52 165 top
SFH18  202.64,76.28 160 top
SFH19  193.12,69.93 100 top
SFH20  178.51,66.75 100 top
SFH21  170.89,56.59 135 top
SFH22  158.19,43.89 135 top
SFH23  149.3,35 165 top
SFH24  144.86,21.67 165 top
SFH25  138.51,9.6 100 top
SFH26  123.27,7.06 100 top
SFH27  116.28,5.79 90 top
SFH28  98.5,5.79 90 top
SFH29  91.52,7.06 75 top
SFH30  75.01,10.87 75 top
SFH31  68.66,21.67 10 top
SFH32  65.48,35 10 top
SFH33  56.59,43.89 45 top
SFH34  43.89,56.59 45 top
SFH35  36.27,66.75 75 top
SFH36  21.67,69.93 75 top
SFH37  12.14,76.28 15 top
SFH38  8.33,91.52 15 top
SFH39  5.79,98.5 0 top
SFH40  5.79,116.28 0 top
SFH41  7.06,123.27 350 top
SFH42  10.87,141.05 350 top
SFH43  21.67,146.13 290 top
SFH44  33.73,150.57 290 top
SFH45  43.89,158.19 315 top
SFH46  56.59,170.89 315 top
SFH47  98.5,146.76 0 top
SFH48  98.5,135.33 0 top
SFH49  33.73,116.28 270 top
SFH50  45.16,116.28 270 top
SFH51  59.13,116.28 270 top
SFH52  70.56,116.28 270 top
SFH53  144.22,116.28 270 top
SFH54  155.65,116.28 270 top
SFH55  169.62,116.28 270 top
SFH56  181.05,116.28 270 top
SFH57  100.41,45.8 0 top
SFH58  100.41,57.23 0 top
SFH59  100.41,71.2 0 top
SFH60  100.41,82.63 0 top

### Tracks (layer width: path | path; a pad name or v marks a point on that pad's centre or on a via)
1
  Top 0.406: MUX1.21 103.94,124.31 102.72,125.53 102.72,131.35 107.52,136.15 107.52,136.54 108.16,137.18 108.16,151.49 94.24,165.41 82.55,165.41 79.81,168.15 79.81,171.65 68.99,182.47 68.99,191.55 SFH1.1 66.86,193.68 64.89,193.68 R1.2
2  (via drill 0.45)
  Top 0.406: v114.08,128.85 114.3,129.07 114.3,137.6 108.71,143.18 108.71,151.74 94.46,165.99 82.8,165.99 80.39,168.4 80.39,171.86 78.8,173.45 R3.2 78.8,177.66 80.52,179.37 SFH2.1 | MUX1.2 113.61,123.01 v113.74,122.88
  Bottom 0.406: v114.08,128.85 113.74,128.51 v113.74,122.88
3
  Top 0.406: MUX1.9 112.41,127.65 113.99,127.65 114.86,128.52 114.86,137.83 109.27,143.42 109.27,151.99 93.44,167.82 R4.2 94.64,172.13 94.64,174.75 SFH3.1
4
  Top 0.406: MUX1.8 112.41,127 114.13,127 115.42,128.29 115.42,138.06 109.83,143.65 109.83,152.27 99.62,162.48 R6.2 99.57,172.8 99.57,175.45 SFH4.1
5
  Top 0.406: SFH5.1 115.33,176.92 116.03,176.23 116.03,173.52 115.31,172.8 R7.2 115.18,172.78 115.18,170.61 110.39,165.82 110.39,143.88 115.98,138.29 115.98,128.06 114.27,126.35 112.41,126.35 MUX1.7
6
  Top 0.406: MUX1.6 114.32,125.61 116.54,127.83 116.54,138.52 110.95,144.11 110.95,165.59 116.02,170.66 R9.2 119.97,171.99 119.97,174.52 SFH6.1
7
  Top 0.406: MUX1.5 114.46,124.96 117.1,127.59 117.1,138.75 111.51,144.34 111.51,165.36 115.31,169.16 123.61,169.16 126.65,166.12 132.32,166.12 136.03,169.84 R10.2 136.03,177.02 133.65,179.41 SFH7.1
8  (via drill 0.45)
  Top 0.406: MUX1.4 114.6,124.31 117.66,127.36 117.66,138.99 112.07,144.57 112.07,165.12 115.54,168.6 123.38,168.6 126.42,165.56 132.55,165.56 136.6,169.61 136.6,171.85 v139.93,175.18 | v145.75,187.4 145.75,190.09 SFH8.1 147.12,193.31 R12.2
  Bottom 0.406: v145.75,187.4 145.75,181 v139.93,175.18
9  (via drill 0.41)
  Top 0.406: MUX1.16 106,127.56 108.08,129.64 108.08,136.31 110.57,138.8 110.57,139.9 v110.75,140.07 | v112.84,144.87 112.64,145.08 112.64,156.98 120.64,164.98 132.77,164.98 138.2,170.41 149.3,170.41 152.37,167.35 R13.2 157.09,167.35 159.21,169.47 159.21,171.22 SFH9.1
  Bottom 0.406: v110.75,140.07 112.84,142.17 v112.84,144.87
10  (via drill 0.41)
  Top 0.406: MUX1.17 106.14,126.91 108.64,129.41 108.64,136.06 111.24,138.67 111.24,139.2 v111.39,139.35 | v113.61,144.11 113.61,145.23 113.2,145.64 113.2,156.74 120.87,164.42 133,164.42 138.44,169.85 149.07,169.85 164.28,154.65 R15.2 171.57,156.22 SFH10.1
  Bottom 0.406: v111.39,139.35 113.61,141.57 v113.61,144.11
11  (via drill 0.41)
  Top 0.406: MUX1.18 106.28,126.26 109.2,129.18 109.2,135.79 v112.07,138.67 | v114.37,143.35 114.37,145.31 113.76,145.92 113.76,156.51 121.1,163.86 133.23,163.86 138.67,169.29 148.84,169.29 170.13,148 R16.2 178.49,149.84 180.09,151.43 SFH11.1
  Bottom 0.406: v112.07,138.67 114.37,140.96 v114.37,143.35
12  (via drill 0.41)
  Top 0.406: MUX1.19 106.42,125.61 109.76,128.95 109.76,135.54 112.1,137.88 112.68,137.88 v112.78,137.99 | v115.13,142.59 115.13,145.36 114.32,146.17 114.32,156.28 121.34,163.3 133.46,163.3 138.9,168.73 148.61,168.73 178.15,139.19 189.98,139.19 R18.2 194.21,143.43 194.21,146.3 SFH12.1
  Bottom 0.406: v112.78,137.99 115.13,140.34 v115.13,142.59
13  (via drill 0.41)
  Top 0.406: MUX1.20 106.56,124.96 110.31,128.72 110.31,135.3 112.22,137.2 113.36,137.2 v113.49,137.33 | v115.89,141.83 115.89,145.41 114.88,146.42 114.88,156.05 121.57,162.74 133.69,162.74 139.13,168.18 148.38,168.18 177.92,138.64 198.49,138.64 R19.2 199.58,139.73 202.59,139.73 SFH13.1
  Bottom 0.406: v113.49,137.33 115.89,139.73 v115.89,141.83
14  (via drill 0.41)
  Top 0.406: v172.58,102.1 175.07,102.1 175.53,101.64 191.81,101.64 201.4,111.23 201.4,117.74 R21.2 207.29,121.26 208.64,122.61 SFH14.1 | v166.4,97.69 129.16,97.69 117.09,109.76 v117.09,110.62 | v117.05,114.02 117.05,121.41 114.8,123.66 MUX1.3
  Bottom 0.406: v172.58,102.1 170.8,102.1 v166.4,97.69 | v117.09,110.62 117.09,113.98 v117.05,114.02
15  (via drill 0.41)
  Top 0.406: v173.41,101.32 174.5,101.32 174.75,101.07 192.02,101.07 R22.2 206.15,114.78 209.1,114.78 209.94,115.63 SFH15.1 | v168.25,98.45 129.18,98.45 118.05,109.59 v118.05,110.62 | v116.26,114.81 116.23,114.84 116.23,116.24 108.82,123.66 MUX1.22
  Bottom 0.406: v173.41,101.32 171.12,101.32 v168.25,98.45 | v118.05,110.62 118.05,114.26 117.48,114.84 116.28,114.84 v116.26,114.81
16  (via drill 0.41)
  Top 0.406: v174.14,100.56 174.19,100.51 202.39,100.51 R24.2 206.07,96.83 209.27,96.83 209.94,97.5 SFH16.1 | v170.15,99.21 129.21,99.21 119.02,109.41 v119.02,110.62 | MUX1.23 108.68,123.01 115.47,116.22 v115.47,115.6
  Bottom 0.406: v174.14,100.56 171.49,100.56 v170.15,99.21 | v119.02,110.62 119.02,114.24 117.66,115.6 v115.47,115.6
17  (via drill 0.41)
  Top 0.406: MUX4.9 v176.33,98.88 | v179.45,98.88 180.14,99.57 196.22,99.57 204.18,91.61 R25.2 205.09,90.25 207.62,90.25 SFH17.1
  Bottom 0.406: v176.33,98.88 v179.45,98.88
18
  Top 0.406: MUX4.8 175.68,96.54 176.05,96.17 194.9,96.17 196.55,94.52 196.55,78.65 R27.2 200.24,74.96 202.54,74.96 SFH18.1
19
  Top 0.406: MUX2.16 116.43,62.6 116.17,62.34 116.17,58.92 118.67,56.41 118.67,19.76 119.36,19.08 132.31,19.08 136.43,23.19 136.43,32.24 154.61,50.43 154.61,52.1 177.82,75.31 191.92,75.31 R28.2 194.57,72.67 194.57,70.11 193.45,68.99 SFH19.1
20
  Top 0.406: MUX2.17 118.14,63.26 116.07,63.26 115.61,62.8 115.61,58.69 118.12,56.18 118.12,19.53 119.13,18.52 132.58,18.52 136.98,22.92 136.98,32.01 155.17,50.2 155.17,51.87 172.98,69.68 R30.2 176.48,67.52 178.18,65.82 SFH20.1
21
  Top 0.406: MUX2.18 115.89,63.89 115.05,63.05 115.05,58.43 117.56,55.93 117.56,19.3 118.9,17.96 132.85,17.96 137.54,22.65 137.54,31.78 155.73,49.97 155.73,51.64 162.22,58.13 R31.2 169.87,55.6 171.25,55.6 SFH21.1
22
  Top 0.406: MUX2.19 115.75,64.54 114.49,63.28 114.49,58.2 117,55.69 117,19.07 118.67,17.4 133.1,17.4 138.1,22.41 138.1,31.55 152.62,46.06 R33.2 155.28,44.92 156.99,43.22 SFH22.1
23
  Top 0.406: MUX2.20 118.15,65.2 115.59,65.2 113.93,63.54 113.93,57.97 116.44,55.46 116.44,18.84 118.43,16.84 133.34,16.84 138.66,22.16 138.66,31.24 142.32,34.9 R34.2 146.72,33.94 149.4,33.94 SFH23.1
24
  Top 0.406: MUX2.21 115.44,65.84 113.37,63.77 113.37,57.74 115.88,55.23 115.88,18.61 118.2,16.28 133.57,16.28 138.85,21.56 R36.2 142.61,20.27 144.63,20.27 SFH24.1
25
  Top 0.406: MUX2.22 118.15,66.5 115.31,66.5 112.81,64 112.81,57.48 115.32,54.97 115.32,18.37 117.97,15.72 136.61,15.72 139.29,13.04 R37.2 140.24,12.06 140.24,9.91 139,8.67 SFH25.1
26
  Top 0.406: MUX2.23 115.16,67.14 112.26,64.24 112.26,57.25 114.76,54.74 114.76,18.14 121.11,11.8 R39.2 121.11,8.25 123.23,6.13 SFH26.1
27
  Top 0.406: MUX2.9 109.17,62.59 108.33,61.75 108.33,60.35 114.2,54.48 114.2,17.88 115.8,16.28 R40.2 114.76,8.56 114.76,6.37 SFH27.1
28
  Top 0.406: MUX2.8 110.84,63.25 108.92,63.25 107.77,62.11 107.77,60.12 113.64,54.25 113.64,19.87 108.21,14.43 101.91,14.43 R42.2 97.08,6.27 SFH28.1
29
  Top 0.406: MUX2.7 108.74,63.89 107.22,62.37 107.22,59.86 113.09,53.99 113.09,20.1 107.97,14.99 98.64,14.99 R43.2 93.53,6.94 92.73,6.15 SFH29.1
30
  Top 0.406: MUX2.6 108.57,64.54 106.66,62.62 106.66,59.63 112.53,53.76 112.53,20.33 107.82,15.62 76.11,15.62 R45.2 73.66,13.17 73.66,11.06 SFH30.1
31
  Top 0.406: MUX2.5 108.43,65.19 106.1,62.85 106.1,59.4 111.97,53.53 111.97,20.56 107.61,16.21 77.41,16.21 R46.2 70.86,20.32 68.9,20.32 SFH31.1
32
  Top 0.406: MUX2.4 108.24,65.84 105.54,63.14 105.54,59.17 111.41,53.3 111.41,20.79 107.41,16.79 81.33,16.79 75.39,22.74 75.39,32.31 70.66,37.04 R48.2 66.58,37.04 64.55,35 SFH32.1
33
  Top 0.406: MUX3.16 41.13,97.49 39.78,98.83 38.64,98.83 35.94,96.14 20.2,96.14 19.43,95.38 19.43,83.57 24.03,78.97 31.3,78.97 35.87,74.4 42.42,74.4 57.49,59.33 R49.2 55.92,45.87 SFH33.1
34
  Top 0.406: MUX3.17 41.79,96.76 41.79,97.62 40.01,99.39 38.4,99.39 35.71,96.7 19.96,96.7 18.87,95.61 18.87,83.34 23.8,78.41 31.06,78.41 35.63,73.84 42.11,73.84 45.17,70.78 R51.2 43.22,58.19 SFH34.1
35
  Top 0.406: MUX3.18 42.43,97.77 40.24,99.95 38.17,99.95 35.48,97.26 19.73,97.26 18.32,95.84 18.32,83.11 23.57,77.85 30.83,77.85 38.27,70.42 38.27,69.57 R52.2 38.51,69.33 38.51,67.65 36.7,65.84 SFH35.1
36  (via drill 0.45)
  Top 0.406: MUX3.19 43.08,97.91 40.47,100.51 37.92,100.51 35.22,97.81 19.5,97.81 17.76,96.07 17.76,88.9 v17.53,88.67 | v17.68,82.43 20.93,79.18 R54.2 20.2,72.74 20.2,70.24 SFH36.1
  Bottom 0.406: v17.53,88.67 17.53,82.57 v17.68,82.43
37  (via drill 0.45)
  Top 0.406: MUX3.20 43.73,98.05 40.7,101.07 37.66,101.07 34.96,98.37 19.27,98.37 17.2,96.3 17.2,89.87 v16.74,89.41 | v16.69,82.17 18.54,80.32 18.57,80.32 18.57,78.4 R55.2 14.82,74.65 12.61,74.65 SFH37.1
  Bottom 0.406: v16.74,89.41 16.69,89.36 v16.69,82.17
38
  Top 0.406: R57.2 11.76,91.78 15.48,91.78 16.64,92.94 16.64,96.53 19.04,98.93 34.71,98.93 37.4,101.63 40.94,101.63 44.38,98.19 MUX3.21 | R57.2 | SFH38.1 8.26,90.43 10.14,90.43 R57.2
39
  Top 0.406: MUX3.22 45.04,96.76 45.04,98.32 41.17,102.19 37.17,102.19 34.48,99.49 18.81,99.49 17.03,97.72 R58.2 8.97,97.57 8.43,97.03 6.32,97.03 SFH39.1
40
  Top 0.406: MUX3.23 45.68,98.47 41.4,102.75 36.91,102.75 34.22,100.05 19.97,100.05 13.79,106.23 13.79,110.09 12.58,111.3 12.58,114.09 R60.2 6.27,117.71 SFH40.1
41
  Top 0.406: MUX3.9 41.13,106.02 40.79,106.35 36.65,106.35 30.91,100.61 20.2,100.61 14.35,106.46 14.35,110.32 13.14,111.53 13.14,114.33 10.72,116.74 10.72,120.5 R61.2 7.3,121.23 6.13,122.4 SFH41.1
42
  Top 0.406: MUX3.8 41.78,106.16 41.03,106.91 36.4,106.91 30.66,101.17 20.43,101.17 14.91,106.69 14.91,110.55 13.7,111.76 13.7,114.56 12.77,115.49 12.77,124.02 18.49,129.75 18.49,136.1 R63.2 13.98,139.45 10.85,139.45 9.94,140.36 SFH42.1
43
  Top 0.406: MUX3.7 42.43,106.3 41.26,107.47 36.14,107.47 30.4,101.73 20.66,101.73 15.47,106.92 15.47,110.78 14.26,111.99 14.26,114.79 13.33,115.72 13.33,123.79 19.05,129.51 19.05,140.55 R64.2 20.22,143.21 20.22,145.9 SFH43.1
44
  Top 0.406: MUX3.6 43.08,106.44 41.49,108.03 35.91,108.03 30.17,102.29 20.9,102.29 16.03,107.15 16.03,111.01 14.82,112.23 14.82,115.02 13.91,115.92 13.91,123.58 19.61,129.28 19.61,136.71 21.62,138.71 32.82,138.71 36.96,142.85 36.96,147.27 R66.2 36.34,149.54 34.42,151.47 SFH44.1
45
  Top 0.406: MUX3.5 43.73,106.58 41.72,108.59 35.68,108.59 29.94,102.84 21.13,102.84 16.59,107.38 16.59,111.24 15.37,112.46 15.37,115.25 14.47,116.15 14.47,123.35 20.17,129.05 20.17,136.47 21.85,138.15 33.12,138.15 47.65,152.68 47.65,156.7 R67.2 47.44,157.04 45.44,159.03 43.39,159.03 SFH45.1
46
  Top 0.406: MUX3.4 44.38,106.72 41.95,109.15 35.45,109.15 29.71,103.4 21.36,103.4 17.15,107.61 17.15,111.47 15.93,112.69 15.93,115.48 15.03,116.39 15.03,123.12 20.73,128.82 20.73,136.24 22.08,137.59 33.36,137.59 58.25,162.49 R69.2 57.47,167.86 55.83,169.5 55.83,171.48 SFH46.1
47
  Top 0.406: MUX3.3 45.03,104.98 46.07,106.02 85.75,106.02 96.11,116.38 96.11,136.61 96.8,137.3 98.95,137.3 100.08,138.43 100.08,144.24 SFH47.1 98.98,148.19 R70.2
48
  Top 0.406: MUX3.2 45.68,104.84 46.25,105.41 86.06,105.41 96.73,116.08 96.73,128.96 R72.2 98.98,133.91 SFH48.1
49  (via drill 0.41)
  Top 0.406: MUX4.19 174.36,104.84 174.36,106.14 171.41,109.1 162.6,109.1 159.66,106.15 131.83,106.15 v130.13,104.45 | v128.1,105.27 120.11,113.26 95.64,113.26 v95.31,113.59 | v92.04,115.05 84.14,107.15 54.58,107.15 51.11,110.62 51.11,113.16 46.2,118.06 44.28,118.06 43.41,117.19 43.41,115.12 42.24,113.95 37.02,113.95 SFH49.1 31.04,114.54 R73.2
  Bottom 0.406: v130.13,104.45 129.24,105.34 128.17,105.34 v128.1,105.27 | v95.31,113.59 93.85,115.05 v92.04,115.05
50  (via drill 0.41)
  Top 0.406: MUX4.23 171.78,105.57 170.49,106.86 163.53,106.86 160.58,103.91 134.67,103.91 131.85,101.09 131.2,101.09 119.59,112.7 94.83,112.7 v94.63,112.91 | v92.87,114.22 85.25,106.59 54.35,106.59 50.55,110.39 50.55,111.99 49.43,113.11 R75.2 | R75.2 | SFH50.1 47.22,115.18 R75.2
  Bottom 0.406: v94.63,112.91 94.18,112.91 v92.87,114.22
51  (via drill 0.41)
  Top 0.406: MUX4.2 171.78,98.66 170.46,99.98 130.74,99.98 119.33,111.38 93.1,111.38 v93.02,111.3 | v61.83,117.25 59.15,117.25 SFH51.1 57.08,115.18 R76.2
  Bottom 0.406: v61.83,117.25 62.35,116.72 87.6,116.72 v93.02,111.3
52  (via drill 0.41)
  Top 0.406: MUX4.3 172.43,98.8 170.69,100.54 130.97,100.54 119.36,112.14 v93.87,112.14 | SFH52.1 70.83,117.5 v72.42,117.5 72.62,117.3 R78.2
  Bottom 0.406: v93.87,112.14 88.73,117.28 72.64,117.28 v72.42,117.5
53  (via drill 0.41)
  Top 0.406: MUX4.4 173.08,98.94 170.92,101.09 143.03,101.09 142.83,101.3 v142.8,101.3 | v142.85,108.08 142.85,112.42 R79.2 142.17,115.18 SFH53.1
  Bottom 0.406: v142.85,108.08 142.85,101.3 v142.8,101.3
54  (via drill 0.41)
  Top 0.406: MUX4.5 173.73,99.08 171.16,101.65 158.02,101.65 v157.74,101.93 | v157.76,109.63 157.76,113.06 R81.2 157.71,115.18 SFH54.1
  Bottom 0.406: v157.76,109.63 157.76,101.96 v157.74,101.93
55  (via drill 0.41)
  Top 0.406: MUX4.6 174.38,99.22 171.39,102.21 164.65,102.21 v164.16,102.69 | v164.14,112.55 164.7,113.11 R82.2 167.57,115.18 SFH55.1
  Bottom 0.406: v164.16,102.69 164.16,108.51 164.14,108.54 v164.14,112.55
56  (via drill 0.41)
  Top 0.406: MUX4.7 175.03,98.77 v175.14,98.88 | v175.8,102.45 180.29,102.45 183.36,105.52 183.36,112.35 R84.2 182.6,115.68 SFH56.1
  Bottom 0.406: v175.14,98.88 175.14,101.8 v175.8,102.45
57  (via drill 0.41)
  Top 0.406: MUX4.18 175.03,106.27 171.64,109.65 162.35,109.65 159.4,106.71 131.24,106.71 v128.97,104.44 | v123.13,100.84 123.13,99.7 121.27,97.84 114.69,97.84 109.12,92.27 109.12,71.01 104.98,66.87 104.98,58.94 109.81,54.11 109.81,46.76 107.42,44.38 R85.2 100.88,44.38 SFH57.1
  Bottom 0.406: v128.97,104.44 v127.09,102.55 127,102.46 124.75,102.46 v123.13,100.84
58  (via drill 0.41)
  Top 0.406: v120.61,99.11 120.53,99.11 119.91,98.49 114.55,98.49 108.56,92.5 108.56,71.25 103.58,66.27 R87.2 100.88,58.65 SFH58.1 | MUX4.22 172.43,105.71 170.72,107.42 163.3,107.42 160.35,104.47 134.04,104.47 v131.47,101.91
  Bottom 0.406: v120.61,99.11 120.85,98.86 128.43,98.86 v131.47,101.91
59  (via drill 0.41)
  Top 0.406: v121.53,99.64 121.15,100.02 120.36,100.02 119.54,99.2 114.47,99.2 108,92.73 108,71.48 106.3,69.78 R88.2 100.88,69.78 SFH59.1 | MUX4.21 173.08,105.85 170.95,107.98 163.07,107.98 160.12,105.03 133.23,105.03 v130.8,102.6
  Bottom 0.406: v121.53,99.64 121.72,99.44 127.64,99.44 v130.8,102.6
60  (via drill 0.41)
  Top 0.406: v122.29,100.24 121.91,100.63 120.11,100.63 119.24,99.76 114.24,99.76 103.58,89.11 R90.2 100.88,84.05 SFH60.1 | MUX4.20 173.73,105.99 171.18,108.54 162.84,108.54 159.89,105.59 132.4,105.59 v130.11,103.3
  Bottom 0.406: v130.11,103.3 126.81,100 122.56,100 122.32,100.24 v122.29,100.24
+3,3V  (via drill 0.3)
  other vias: 92.41,106.25 92.41,107.14 92.41,108.03 93.3,108.03 94.19,108.03 95.07,108.03 95.96,108.03 96.85,108.03 96.85,107.14 95.96,107.14 95.07,107.14 94.19,107.14 93.3,107.14 93.3,106.25 94.19,106.25 95.07,106.25 95.96,106.25 96.85,106.25 92.28,98.76 92.28,99.65 92.28,100.54 93.17,100.54 94.06,100.54 94.95,100.54 95.84,100.54 96.73,100.54 96.73,99.65 95.84,99.65 94.95,99.65 94.06,99.65 93.17,99.65 93.17,98.76 94.06,98.76 94.95,98.76 95.84,98.76 96.73,98.76
  pour Top (rank 2, no thermals): -19.15,114.63 -19.15,50.4 10.11,21.14 39.42,-8.18 164.75,-8.18 191.57,-8.18 226.95,27.21 236.68,36.93 236.68,140.57 236.68,195.76 204.98,227.46 18.9,227.46 -2.03,206.53 -19.15,189.41
  pour Bottom: 91.65,108.41 91.65,98.12 97.61,98.12 97.61,108.66 91.65,108.66 91.65,108.54
+5V  (via drill 0.41)
  Top 0.406: v131.46,107.47 131.66,107.27 159.17,107.27 162.12,110.21 165.18,110.21 v165.38,110.42 | MUX4.24 170.08,104.83 v169.88,105.03 | v115.58,95.68 115.58,92.93 115.37,92.72 115.37,74.56 v115.17,74.36 | v117.25,74.12 118.16,73.21 MUX2.24 | v115.34,114.02 114.43,114.94 114.43,116.47 108.54,122.36 MUX1.24 | MUX3.24 46.33,97.76 47.3,98.74 v48.84,98.74 | v55.75,102.42 103.04,102.42 v103.55,101.9 | v106.83,101.81 115.15,101.81 v115.58,101.37
  Bottom 0.406: 115.29,107.47 115.09,107.47 JP1.2 115.58,104.29 v115.58,101.37 v115.58,95.68 | 115.29,107.47 v131.46,107.47 | v169.88,105.03 165.38,109.53 v165.38,110.42 | v115.17,74.36 117.01,74.36 v117.25,74.12 | 115.29,107.47 115.29,113.97 v115.34,114.02 | v48.84,98.74 52.07,98.74 v55.75,102.42 | v103.55,101.9 106.74,101.9 v106.83,101.81
ADFAF1
  Top 0.838: R5.2 84.17,170.9 LED_2.456
ADFAF2
  Top 0.838: R8.2 107.39,167.87 LED_3.456
ADFAF3
  Top 0.838: LED_4.456 129.58,170.44 R11.2
ADFAF4
  Top 0.838: R2.2 64.92,179.86 66.87,181.8 LED_1.456
ADFAF5
  Top 0.838: LED_5.456 148.2,181.38 R14.2
ADFAF6
  Top 0.838: R17.2 161.44,162.56 LED_6.456
ADFAF7
  Top 0.838: R20.2 184.63,144.23 LED_7.456
ADFAF8
  Top 0.838: R23.2 200.63,130.74 LED_8.456
ADFAF9
  Top 0.838: R26.2 204.77,108.82 LED_9.456
ADFAF10
  Top 0.838: R29.2 201.12,85.34 201.12,84.53 201.28,84.7 LED_10.456
ADFAF11
  Top 0.838: R32.2 186.39,71.52 LED_11.456
ADFAF12
  Top 0.838: LED_12.456 162.56,54.36 R35.2
ADFAF13
  Top 0.838: R38.2 143.59,29.38 LED_13.456
ADFAF14
  Top 0.838: LED_14.456 131.27,11.96 R41.2
ADFAF15
  Top 0.838: R44.2 108.82,10.02 LED_15.456
ADFAF16
  Top 0.838: R47.2 84.62,11.13 LED_16.456
ADFAF17
  Top 0.838: LED_17.456 71.52,28.4 R50.2
ADFAF18
  Top 0.838: LED_18.456 54.49,52.22 R53.2
ADFAF19
  Top 0.838: LED_19.456 31.55,72.9 R56.2
ADFAF20
  Top 0.838: LED_20.456 14.15,84.05 R59.2
ADFAF21
  Top 0.838: LED_21.456 10.02,105.97 R62.2
ADFAF22
  Top 0.838: LED_22.456 15.43,129.87 R65.2
ADFAF23
  Top 0.838: R68.2 28.84,143.36 LED_23.456
ADFAF24
  Top 0.838: R71.2 52.22,161.19 LED_24.456
ADFAF25
  Top 0.838: LED_25.456 104.63,139.63 R74.2
ADFAF26
  Top 0.838: LED_26.456 43.21,111.58 R77.2
ADFAF27
  Top 0.838: R80.2 66.27,110.16 LED_27.456
ADFAF28
  Top 0.838: R83.2 148.52,110.16 LED_28.456
ADFAF29
  Top 0.838: LED_29.456 178.32,111.58 R86.2
ADFAF30
  Top 0.838: LED_30.456 104.63,75.49 R89.2
ADFAF31
  Top 0.838: LED_31.456 105.27,50.09 R92.2
GND  (via drill 0.41, 0.51, 1.02)  (90 unrouted)
  Top 0.406: MUX2.12 110.85,59.82 v110.87,59.79 | MUX1.12 v112.32,130.48 | MUX1.15 103.65,128.21 v103.63,128.22 | v176.35,106.17 176.64,105.88 176.65,105.88 176.98,105.55 MUX4.15 | MUX2.15 119.5,61.94 v119.51,61.93
  Top 1.016: v64.9,115.34 64.9,117.13 LED_27.123
  other vias: 166.55,48.29 112.96,9.53 179.61,97.39 179.81,113.13 175.49,117.2 170.49,113.16 154.87,113.16 145.14,113.16 205.92,117.78 204.27,124.01 199.85,136.48 190.5,143.64 181.18,146.71 168.07,156.64 155.12,169.22 150.78,193.27 133.33,174.73 124.01,171.6 102.57,172.8 112.35,172.75 91.04,172.04 81.51,174.91 66.65,195.66 60.28,169.95 45.42,154.87 33.66,146.89 23.65,143.44 14.99,142.9 10.49,124.06 8.99,114.86 9.04,100.64 10.87,94.8 14.96,78.39 23.68,72.54 35.54,70.23 47.12,58.07 59.57,45.42 68.76,34.32 71.6,24.44 77.78,13.62 90.86,10.54 100.08,9.58 123.8,10.34 136.48,12.5 142.12,24.26 146.48,37.59 157.23,47.98 169.34,60.05 190.93,72.85 179.17,70.16 199.93,78.79 204.9,93.75 205.84,99.88 101.63,136.76 101.75,145.26 97.49,140.9 69.8,113.16 60.02,113.16 44.45,113.13 33.94,113.16 103.56,81.16 103.61,72.65 103.58,55.86 103.61,47.25 98.22,51.31 97.67,76.76 39.68,117.1 150.09,117.12 107.62,2.72 131.4,5.36 149.53,27.87 186.59,65.18 206.63,82.73 211.86,107.29 206.61,131.45 187.33,149.2 166.55,166.5 142.93,184.18 128.07,176.02 107.5,174.98 86.92,175.74 71.68,184.94 48.34,166.55 27.76,149.35 7.95,132.64 3.05,107.29 8.18,83.26 28.04,65.15 48.31,48.29 65.25,28.17 83.19,5.54 39.25,98.02 38.38,104.04
  pour Bottom (rank 2, no thermals): -4.37,242.01 235.66,242.01 294.08,183.59 294.08,41.35 205.18,-47.55 43.89,-47.55 -11.99,8.33 -11.99,234.39
  pour Top (no thermals): 37.82,104.9 37.82,103.15 39.52,103.15 39.52,104.9
  pour Top (no thermals): 40.13,96.04 40.85,96.04 40.85,97.64 39.78,98.71 38.61,98.71 38.61,97.54 39.88,97.54 40.13,97.28
  pour Top (no thermals): 178.01,98.25 178.01,96.6 180.55,96.6 180.55,98.25
S0  (via drill 0.41)
  Top 0.406: MUX4.10 176.98,98.44 177.37,98.83 v177.37,99.75 | v177.35,103.21 167.53,103.21 166.32,104.42 163.05,104.42 161.32,102.69 135.62,102.69 v134.72,101.79 | MUX1.10 111.39,128.21 110.2,127.02 v110.2,123.36 | MUX3.10 40.48,105.48 v40.36,105.59 | v48.85,104.65 49.05,104.85 97.11,104.85 99.6,107.34 109.98,107.34 JP1.4 114.02,103.31 121.22,103.31 v121.72,102.8 122.47,102.8 123.94,101.33 123.94,99.7 116.49,92.26 116.49,72.77 115.09,71.38 v114.33,71.38 | MUX2.10 109.6,61.94 v109.49,61.83
  Bottom 0.406: v177.37,99.75 177.37,103.19 v177.35,103.21 | v134.72,101.79 130.23,106.28 125.2,106.28 v121.72,102.8 | v110.2,123.36 109.93,123.09 109.93,107.39 JP1.4 | v40.36,105.59 47.91,105.59 v48.85,104.65 | v109.49,61.83 114.33,66.67 v114.33,71.38
S1  (via drill 0.41)
  Top 0.406: MUX4.11 177.63,98.3 178.13,98.81 178.13,99.52 v178.34,99.72 | v170.21,103.98 167.56,103.98 166.55,104.98 162.44,104.98 160.82,103.35 135.19,103.35 v134.84,103.01 | v118.77,102.5 112.29,102.5 JP1.6 106.83,104.29 49.89,104.29 49.28,103.69 v48.72,103.69 | MUX1.11 111.25,128.86 109.37,126.99 v109.37,124.18 | MUX3.11 39.83,105.04 v39.27,105.59 | MUX2.11 110.08,61.29 v109.53,60.73 | v115.17,73.28 115.93,74.04 115.93,92.49 116.66,93.22 v116.66,97
  Bottom 0.406: v178.34,99.72 178.34,103.58 177.75,104.17 175.95,104.17 175.76,103.98 v170.21,103.98 | v134.84,103.01 131.02,106.83 124.64,106.83 120.3,102.5 v118.77,102.5 118.77,99.11 v116.66,97 | v109.37,124.18 107.37,122.18 107.37,107.42 JP1.6 | v39.27,105.59 39.29,105.59 40.05,104.83 47.58,104.83 v48.72,103.69 | v109.53,60.73 115.17,66.37 v115.17,73.28
S2  (via drill 0.41)
  Top 0.406: MUX3.14 39.83,96.03 40.2,95.66 46.84,95.66 54.92,103.74 105.84,103.74 v106.05,103.53 106.05,99.65 v109.55,96.15 | v106.61,129.26 106.22,128.86 MUX1.14 | v117.03,59.46 117.03,60.94 117.38,61.29 MUX2.14 | v116.16,69.93 115.62,70.46 114.15,70.46 112.83,71.78 112.83,92.92 v112.37,93.37 | MUX4.14 177.63,105.97 175.59,108 174.09,108 170.91,111.18 162.29,111.18 159.14,108.03 v153.14,108.03
  Bottom 0.406: v106.05,103.53 106.12,103.61 JP1.8 104.88,107.37 104.88,110.93 105.58,111.63 105.58,128.23 v106.61,129.26 | v117.03,59.46 116.16,60.34 v116.16,69.93 | v109.55,96.15 109.6,96.15 v112.37,93.37 114.35,93.37 119.26,98.27 144.1,98.27 153.14,107.32 v153.14,108.03
S3  (via drill 0.41)
  Top 0.406: MUX3.13 v38.23,96.75 | v48.47,96.21 55.44,103.18 103.35,103.18 v103.56,102.97 105.49,101.04 105.49,99.13 108.86,95.75 v108.86,95.46 | MUX1.13 105.01,129.76 104.01,130.76 104.01,130.79 v103.63,131.18 | MUX2.13 118.11,60.59 v118.11,59.79 | v117.15,69.01 114.81,69.01 112.27,71.55 112.27,92.11 v111.69,92.69 | MUX4.13 178.28,106.11 175.82,108.56 174.32,108.56 171.14,111.74 162.06,111.74 159.12,108.79 v154.92,108.79 | v102.44,123.01 v102.44,115.65
  Bottom 0.406: v38.23,96.75 39.32,95.66 47.91,95.66 v48.47,96.21 | v103.56,102.97 103.58,103 JP1.10 102.44,107.27 v102.44,115.65 | v103.63,131.18 102.87,131.18 102.44,130.75 v102.44,123.01 | v118.11,59.79 118.11,61.47 117.15,62.44 v117.15,69.01 | v108.86,95.46 108.92,95.46 v111.69,92.69 112.12,92.26 114.15,92.26 119.61,97.72 144.35,97.72 154.92,108.28 v154.92,108.79
SIGNAL_OUT_0  (via drill 0.41)
  Top 0.406: v112.33,121.22 112.32,121.23 MUX1.1
  Bottom 0.406: JP1.1 112.33,110.08 v112.33,121.22
SIGNAL_OUT_1  (via drill 0.41)
  Top 0.406: v112.61,94.68 109.68,91.75 109.68,68.96 MUX2.1
  Bottom 0.406: JP1.3 112.5,107.37 112.5,94.8 v112.61,94.68
SIGNAL_OUT_2  (via drill 0.41)
  Top 0.406: JP1.5 107.51,109.82 104.82,109.82 103.81,110.82 93.73,110.82 92.84,109.93 91.37,109.93 87.34,105.9 v87.34,105.62 | v53.64,103.53 52.8,102.69 47.7,102.69 MUX3.1
  Bottom 0.406: v87.34,105.62 85.26,103.53 v53.64,103.53
SIGNAL_OUT_3  (via drill 0.41)
  Top 0.406: MUX4.1 170.49,96.88 129.18,96.88 115.23,110.82 106.35,110.82 v106.15,110.62
  Bottom 0.406: v106.15,110.62 106.12,110.59 JP1.7